# EAGLE design Proiect_TSC_2025 (EAGLE 9.7.0)
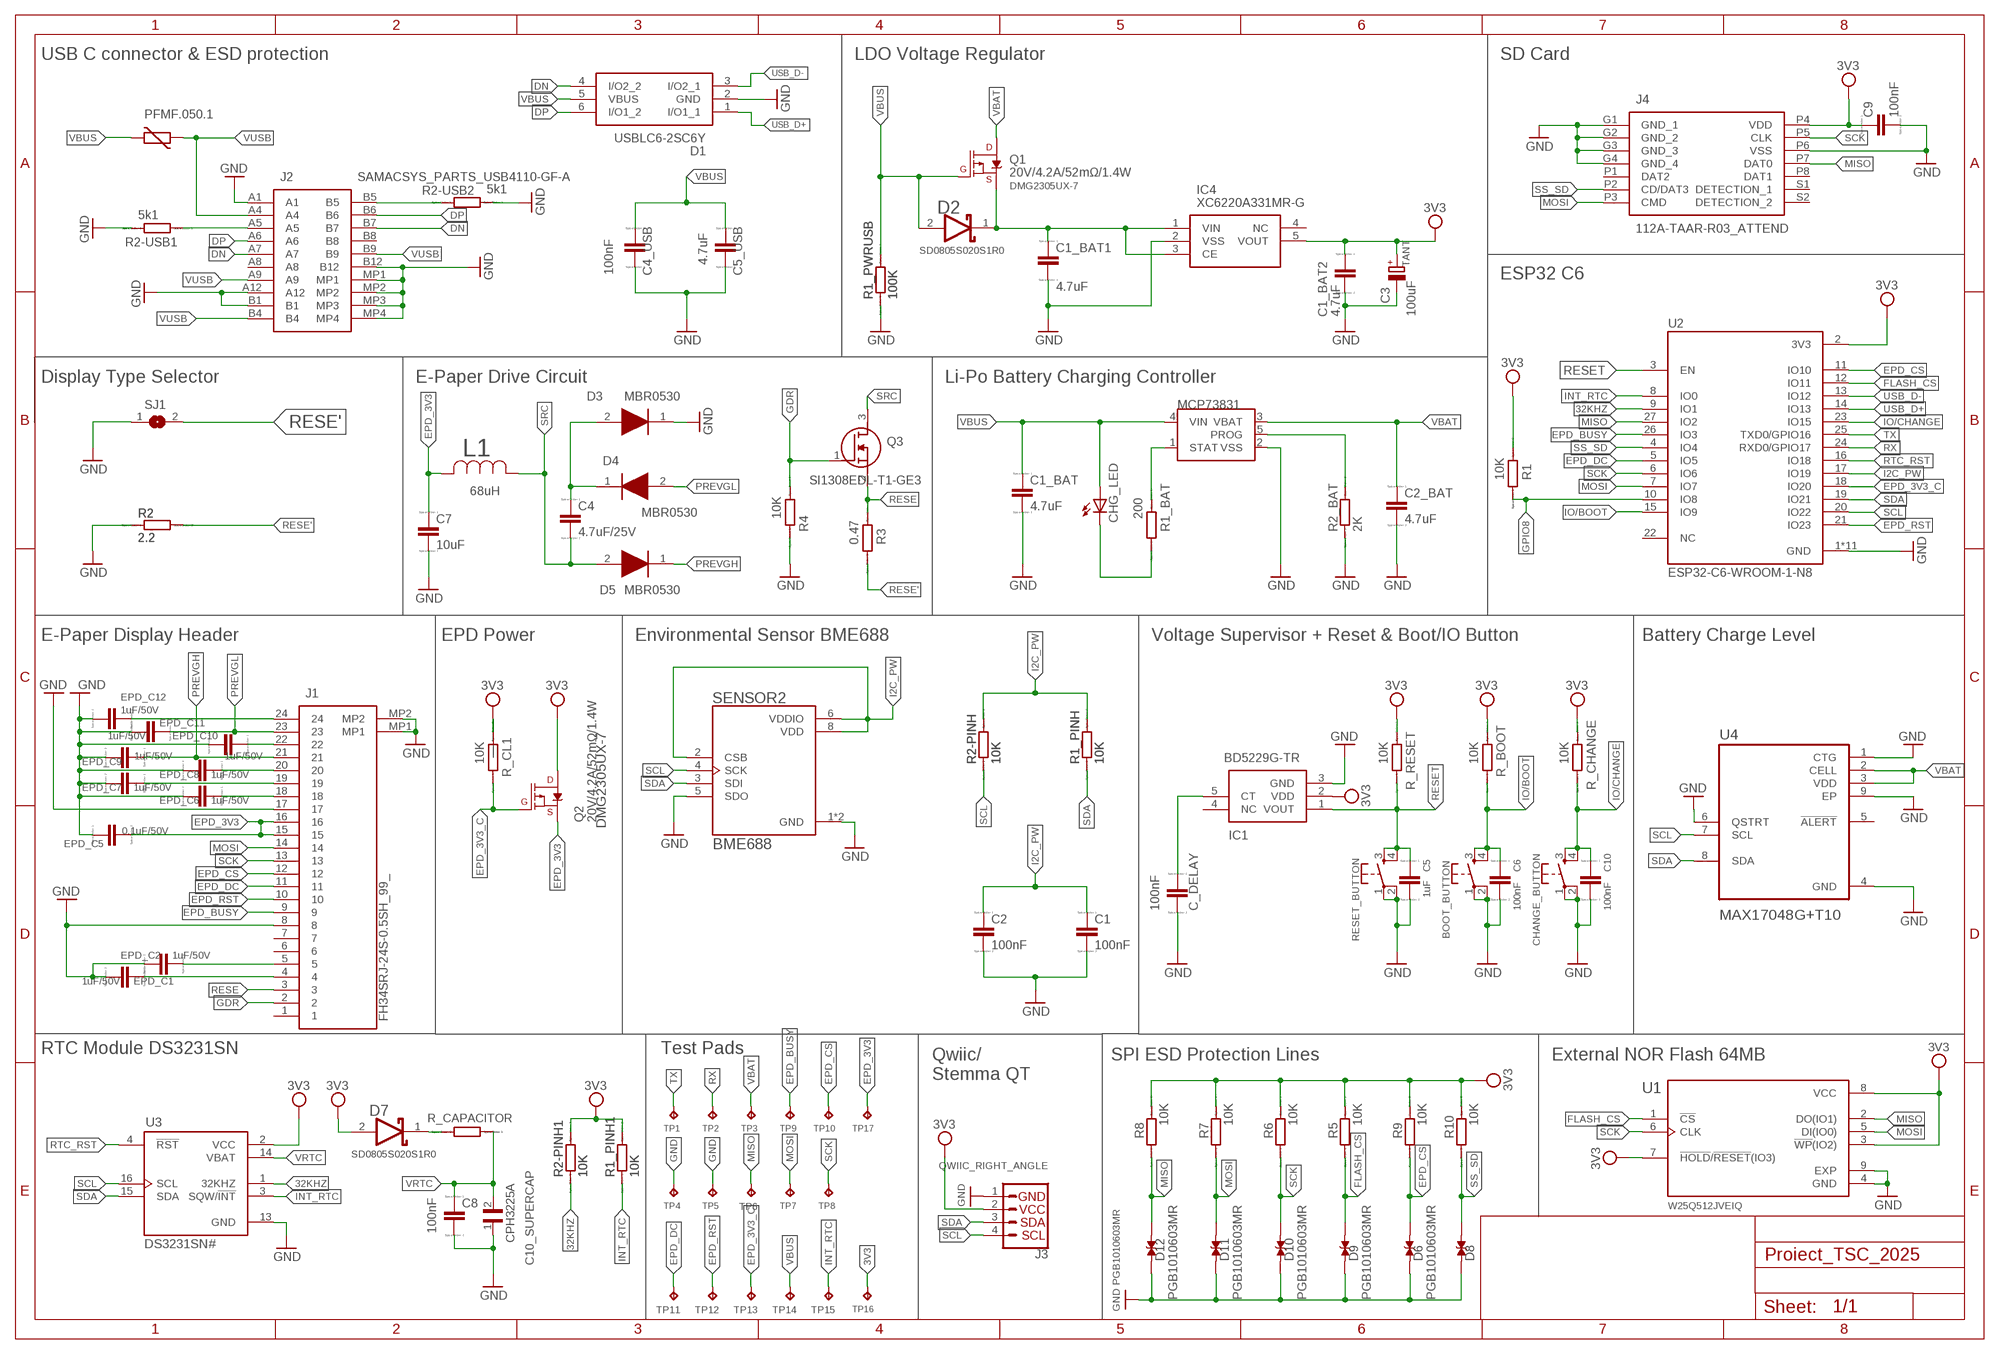
[diagram p0: schematic, sheet 1]

## Parts
BOOT_BUTTON  BUTTON_CUSYOMV1  [MYBUTTON]
C1  100nF  ESP32_WROVER_EAGLE-LTSPICE_CC0402  [ESP32_WROVER_EAGLE-LTSPICE_C0402]
C1_BAT  4.7uF  ESP32_WROVER_EAGLE-LTSPICE_CC0402  [ESP32_WROVER_EAGLE-LTSPICE_C0402]
C1_BAT1  4.7uF  ESP32_WROVER_EAGLE-LTSPICE_CC0402  [ESP32_WROVER_EAGLE-LTSPICE_C0402]
C1_BAT2  4.7uF  ESP32_WROVER_EAGLE-LTSPICE_CC0402  [ESP32_WROVER_EAGLE-LTSPICE_C0402]
C2  100nF  ESP32_WROVER_EAGLE-LTSPICE_CC0402  [ESP32_WROVER_EAGLE-LTSPICE_C0402]
C2_BAT  4.7uF  ESP32_WROVER_EAGLE-LTSPICE_CC0402  [ESP32_WROVER_EAGLE-LTSPICE_C0402]
C3  100uF  RCL_CPOL-EUCT3528  [RCL_CT3528]
C4  4.7uF/25V  ESP32_WROVER_EAGLE-LTSPICE_CC0402  [ESP32_WROVER_EAGLE-LTSPICE_C0402]
C4_USB  100nF  EAGLE-LTSPICE_CC0402  [EAGLE-LTSPICE_C0402]
C5  1uF  ESP32_WROVER_EAGLE-LTSPICE_CC0402  [ESP32_WROVER_EAGLE-LTSPICE_C0402]
C5_USB  4.7uF  EAGLE-LTSPICE_CC0402  [EAGLE-LTSPICE_C0402]
C6  100nF  ESP32_WROVER_EAGLE-LTSPICE_CC0402  [ESP32_WROVER_EAGLE-LTSPICE_C0402]
C7  10uF  ESP32_WROVER_EAGLE-LTSPICE_CC0402  [ESP32_WROVER_EAGLE-LTSPICE_C0402]
C8  100nF  ESP32_WROVER_EAGLE-LTSPICE_CC0402  [ESP32_WROVER_EAGLE-LTSPICE_C0402]
C9  100nF  ESP32_WROVER_EAGLE-LTSPICE_CC0402  [ESP32_WROVER_EAGLE-LTSPICE_C0402]
C10  100nF  ESP32_WROVER_EAGLE-LTSPICE_CC0402  [ESP32_WROVER_EAGLE-LTSPICE_C0402]
C10_SUPERCAP  CPH3225A  [CAPCP3225X100N]
C_DELAY  100nF  ESP32_WROVER_EAGLE-LTSPICE_CC0402  [ESP32_WROVER_EAGLE-LTSPICE_C0402]
CHANGE_BUTTON  CHANGE_BUTTON  BUTTON_CUSYOMV1  [MYBUTTON]
CHG_LED  ADAFRUIT_LEDCHIP-LED0603  [ADAFRUIT_CHIP-LED0603]
D1  USBLC6-2SC6Y  [SOT95P280X145-6N]
D2  ESP32_WROVER_AVX---SD0805S020S1R0_AVX_SD0805S020S1R0_0_0AVX_SD0805S020S1R0_0_0  [ESP32_WROVER_AVX---SD0805S020S1R0_AVX_SD0805S020S1R0_0]
D3  MBR0530  [SOD3716X135N]
D4  MBR0530  [SOD3716X135N]
D5  MBR0530  [SOD3716X135N]
D6  PGB1010603MR  [DIOC1608X36N]
D7  SD0805S020S1R0  ESP32_WROVER_AVX---SD0805S020S1R0_AVX_SD0805S020S1R0_0_0AVX_SD0805S020S1R0_0_0  [ESP32_WROVER_AVX---SD0805S020S1R0_AVX_SD0805S020S1R0_0]
D8  PGB1010603MR  [DIOC1608X36N]
D9  PGB1010603MR  [DIOC1608X36N]
D10  PGB1010603MR  [DIOC1608X36N]
D11  PGB1010603MR  [DIOC1608X36N]
D12  PGB1010603MR  [DIOC1608X36N]
EPD_C1  1uF/50V  ESP32_WROVER_EAGLE-LTSPICE_CC0402  [ESP32_WROVER_EAGLE-LTSPICE_C0402]
EPD_C2  1uF/50V  ESP32_WROVER_EAGLE-LTSPICE_CC0402  [ESP32_WROVER_EAGLE-LTSPICE_C0402]
EPD_C5  0.1uF/50V  ESP32_WROVER_EAGLE-LTSPICE_CC0402  [ESP32_WROVER_EAGLE-LTSPICE_C0402]
EPD_C6  1uF/50V  ESP32_WROVER_EAGLE-LTSPICE_CC0402  [ESP32_WROVER_EAGLE-LTSPICE_C0402]
EPD_C7  1uF/50V  ESP32_WROVER_EAGLE-LTSPICE_CC0402  [ESP32_WROVER_EAGLE-LTSPICE_C0402]
EPD_C8  1uF/50V  ESP32_WROVER_EAGLE-LTSPICE_CC0402  [ESP32_WROVER_EAGLE-LTSPICE_C0402]
EPD_C9  1uF/50V  ESP32_WROVER_EAGLE-LTSPICE_CC0402  [ESP32_WROVER_EAGLE-LTSPICE_C0402]
EPD_C10  1uF/50V  ESP32_WROVER_EAGLE-LTSPICE_CC0402  [ESP32_WROVER_EAGLE-LTSPICE_C0402]
EPD_C11  1uF/50V  ESP32_WROVER_EAGLE-LTSPICE_CC0402  [ESP32_WROVER_EAGLE-LTSPICE_C0402]
EPD_C12  1uF/50V  ESP32_WROVER_EAGLE-LTSPICE_CC0402  [ESP32_WROVER_EAGLE-LTSPICE_C0402]
IC1  BD5229G-TR  [SOT95P280X125-5N]
IC4  XC6220A331MR-G  [SOT95P280X120-5N]
J1  FH34SRJ-24S-0.5SH_99_  [FH34SRJ24S05SH99]
J2  SAMACSYS_PARTS_USB4110-GF-A  [SAMACSYS_PARTS_USB4110GFA]
J3  QWIIC_RIGHT_ANGLE  QWIIC_CONNECTORJS-1MM  [JST04_1MM_RA]
J4  112A-TAAR-R03_ATTEND  [112ATAARR03ATTEND]
L1  68uH  744043680IND_4828-WE-TPC_WRE  [IND_4828-WE-TPC_WRE]
MCP73831  MCP73831  ESP32_WROVER_SPARKFUN-IC-POWER_MCP73831  [ESP32_WROVER_SPARKFUN-IC-POWER_SOT23-5]
PFMF.050.1  ESP32C6_VARISTORCN1812  [ESP32C6_VARISTOR_CT/CN1812]
Q1  20V/4.2A/52mΩ/1.4W  ESP32_WROVER_SPARKFUN-DISCRETESEMI_MOSFET_PCH-DMG2305UX-7  [ESP32_WROVER_SPARKFUN-DISCRETESEMI_SOT23-3]
Q2  20V/4.2A/52mΩ/1.4W  ESP32_WROVER_SPARKFUN-DISCRETESEMI_MOSFET_PCH-DMG2305UX-7  [ESP32_WROVER_SPARKFUN-DISCRETESEMI_SOT23-3]
Q3  SI1308EDL-T1-GE3  [SOT65P210X110-3N]
R1  10K  ESP32_WROVER_EAGLE-LTSPICE_RR0402  [ESP32_WROVER_EAGLE-LTSPICE_R0402]
R1_BAT  200  ESP32_WROVER_EAGLE-LTSPICE_RR0402  [ESP32_WROVER_EAGLE-LTSPICE_R0402]
R1_PINH  10K  ESP32_WROVER_EAGLE-LTSPICE_RR0402  [ESP32_WROVER_EAGLE-LTSPICE_R0402]
R1_PINH1  10K  ESP32_WROVER_EAGLE-LTSPICE_RR0402  [ESP32_WROVER_EAGLE-LTSPICE_R0402]
R1_PWRUSB  100K  ESP32_WROVER_EAGLE-LTSPICE_RR0402  [ESP32_WROVER_EAGLE-LTSPICE_R0402]
R2  2.2  ESP32_WROVER_EAGLE-LTSPICE_RR0402  [ESP32_WROVER_EAGLE-LTSPICE_R0402]
R2-PINH  10K  ESP32_WROVER_EAGLE-LTSPICE_RR0402  [ESP32_WROVER_EAGLE-LTSPICE_R0402]
R2-PINH1  10K  ESP32_WROVER_EAGLE-LTSPICE_RR0402  [ESP32_WROVER_EAGLE-LTSPICE_R0402]
R2-USB1  5k1  ESP32_WROVER_EAGLE-LTSPICE_RR0402  [ESP32_WROVER_EAGLE-LTSPICE_R0402]
R2-USB2  5k1  ESP32_WROVER_EAGLE-LTSPICE_RR0402  [ESP32_WROVER_EAGLE-LTSPICE_R0402]
R2_BAT  2K  ESP32_WROVER_EAGLE-LTSPICE_RR0402  [ESP32_WROVER_EAGLE-LTSPICE_R0402]
R3  0.47  ESP32_WROVER_EAGLE-LTSPICE_RR0402  [ESP32_WROVER_EAGLE-LTSPICE_R0402]
R4  10K  ESP32_WROVER_EAGLE-LTSPICE_RR0402  [ESP32_WROVER_EAGLE-LTSPICE_R0402]
R5  10K  ESP32_WROVER_EAGLE-LTSPICE_RR0402  [ESP32_WROVER_EAGLE-LTSPICE_R0402]
R6  10K  ESP32_WROVER_EAGLE-LTSPICE_RR0402  [ESP32_WROVER_EAGLE-LTSPICE_R0402]
R7  10K  ESP32_WROVER_EAGLE-LTSPICE_RR0402  [ESP32_WROVER_EAGLE-LTSPICE_R0402]
R8  10K  ESP32_WROVER_EAGLE-LTSPICE_RR0402  [ESP32_WROVER_EAGLE-LTSPICE_R0402]
R9  10K  ESP32_WROVER_EAGLE-LTSPICE_RR0402  [ESP32_WROVER_EAGLE-LTSPICE_R0402]
R10  10K  ESP32_WROVER_EAGLE-LTSPICE_RR0402  [ESP32_WROVER_EAGLE-LTSPICE_R0402]
R_BOOT  10K  ESP32_WROVER_EAGLE-LTSPICE_RR0402  [ESP32_WROVER_EAGLE-LTSPICE_R0402]
R_CAPACITOR  ESP32_WROVER_EAGLE-LTSPICE_RR0402  [ESP32_WROVER_EAGLE-LTSPICE_R0402]
R_CHANGE  10K  ESP32_WROVER_EAGLE-LTSPICE_RR0402  [ESP32_WROVER_EAGLE-LTSPICE_R0402]
R_CL1  10K  ESP32_WROVER_EAGLE-LTSPICE_RR0402  [ESP32_WROVER_EAGLE-LTSPICE_R0402]
R_RESET  10K  ESP32_WROVER_EAGLE-LTSPICE_RR0402  [ESP32_WROVER_EAGLE-LTSPICE_R0402]
RESET_BUTTON  BUTTON_CUSYOMV1  [MYBUTTON]
SENSOR2  BME688  ESP32_WROVER_BME680_BME680  [ESP32_WROVER_BME680_PSON80P300X300X100-8N]
SJ1  0  SJ  [SJ]
TP1  TPTP20R  [TP20R]
TP2  TPTP20R  [TP20R]
TP3  TPTP20R  [TP20R]
TP4  TPTP20R  [TP20R]
TP5  TPTP20R  [TP20R]
TP6  TPTP20R  [TP20R]
TP7  TPTP20R  [TP20R]
TP8  TPTP20R  [TP20R]
TP9  TPTP20R  [TP20R]
TP10  TPTP20R  [TP20R]
TP11  TPTP20R  [TP20R]
TP12  TPTP20R  [TP20R]
TP13  TPTP20R  [TP20R]
TP14  TPTP20R  [TP20R]
TP15  TPTP20R  [TP20R]
TP16  TPTP20R  [TP20R]
TP17  TPTP20R  [TP20R]
U1  W25Q512JVEIQ  [SON127P600X800X80-9N]
U2  ESP32-C6-WROOM-1-N8  [XCVR_ESP32-C6-WROOM-1-N8]
U3  DS3231SN#  [SOIC127P1032X265-16N]
U4  MAX17048G+T10  [SON50P200X200X80-9N]

## Nets
3V3: C1_BAT2.1 C3.+ C9.1 D7.2(ANODE) IC1.2(VDD) IC4.5(VOUT) J3.2 J4.P4(VDD) Q2.3(D) R1.2 R1_PINH1.2 R2-PINH1.2 R5.2 R6.2 R7.2 R8.2 R9.2 R10.2 R_BOOT.2 R_CHANGE.2 R_CL1.2 R_RESET.2 TP16.TP U1.3(!WP!(IO2)) U1.7(!HOLD!/!RESET!(IO3)) U1.8(VCC) U2.2(3V3) U3.2(VCC)
32KHZ: R2-PINH1.1 U2.9(IO1) U3.1(32KHZ)
DN: D1.4(I/O2_2) J2.A7 J2.B7
DP: D1.6(I/O1_2) J2.A6 J2.B6
EPD_3V3: C7.1 EPD_C5.2 J1.15 J1.16 L1.2 Q2.2(S) TP17.TP
EPD_3V3_C: Q2.1(G) R_CL1.1 TP13.TP U2.18(IO20)
EPD_BUSY: J1.9 TP9.TP U2.26(IO3)
EPD_CS: D6.2 J1.12 R9.1 TP10.TP U2.11(IO10)
EPD_DC: J1.11 TP11.TP U2.5(IO5)
EPD_RST: J1.10 TP12.TP U2.21(IO23)
FLASH_CS: D9.2 R5.1 U1.1(!CS) U2.12(IO11)
GDR: J1.2 Q3.1(G) R4.2
GND: BOOT_BUTTON.1 BOOT_BUTTON.2 C1.2 C1_BAT1.2 C1_BAT2.2 C1_BAT.2 C2.2 C2_BAT.2 C3.- C4_USB.2 C5.2 C5_USB.2 C6.2 C7.2 C8.2 C9.2 C10.2 C10_SUPERCAP.1 C_DELAY.2 CHANGE_BUTTON.1 CHANGE_BUTTON.2 D1.2(GND) D3.1(K) D6.1 D8.1 D9.1 D10.1 D11.1 D12.1 EPD_C1.2 EPD_C2.2 EPD_C5.1 EPD_C6.2 EPD_C7.2 EPD_C8.2 EPD_C9.2 EPD_C10.2 EPD_C11.2 EPD_C12.2 IC1.3(GND) IC4.2(VSS) J1.8 J1.17 J1.MP1 J1.MP2 J2.A1 J2.A12 J2.B1 J2.B12 J2.MP1 J2.MP2 J2.MP3 J2.MP4 J3.1 J4.G1(GND_1) J4.G2(GND_2) J4.G3(GND_3) J4.G4(GND_4) J4.P6(VSS) MCP73831.2(VSS) R1_PWRUSB.1 R2-USB1.1 R2-USB2.2 R2.1 R2_BAT.1 R4.1 RESET_BUTTON.1 RESET_BUTTON.2 SENSOR2.1(GND) SENSOR2.5(SDO) SENSOR2.7(GND) SJ1.1 TP4.TP TP5.TP U1.4(GND) U1.9(EXP) U2.1(GND) U2.28(GND) U2.29_1(GND) U2.29_2(GND) U2.29_3(GND) U2.29_4(GND) U2.29_5(GND) U2.29_6(GND) U2.29_7(GND) U2.29_8(GND) U2.29_9(GND) U3.13(GND) U4.1(CTG) U4.4(GND) U4.6(QSTRT) U4.9(EP) ; supply symbol labelled GND PGB1010603MR
GPIO8: R1.1 U2.10(IO8)
I2C_PW: C1.1 C2.1 R1_PINH.2 R2-PINH.2 SENSOR2.2(CSB) SENSOR2.6(VDDIO) SENSOR2.8(VDD) U2.17(IO19)
INT_RTC: R1_PINH1.1 TP15.TP U2.8(IO0) U3.3(SQW/!INT)
IO/BOOT: BOOT_BUTTON.3 BOOT_BUTTON.4 C6.1 R_BOOT.1 U2.15(IO9)
IO/CHANGE: C10.1 CHANGE_BUTTON.3 CHANGE_BUTTON.4 R_CHANGE.1 U2.23(IO15)
MISO: D12.2 J4.P7(DAT0) R8.1 TP6.TP U1.2(DO(IO1)) U2.27(IO2)
MOSI: D11.2 J1.14 J4.P3(CMD) R7.1 TP7.TP U1.5(DI(IO0)) U2.7(IO7)
N$1: J2.A5 R2-USB1.2
N$3: J2.B5 R2-USB2.1
N$12: C1_BAT1.1 D2.1(CATHODE) IC4.1(VIN) IC4.3(CE) Q1.2(S)
N$17: C4.1 D3.2(A) D4.1(K)
N$22: CHG_LED.C R1_BAT.1
N$23: MCP73831.1(STAT) R1_BAT.2
N$25: MCP73831.5(PROG) R2_BAT.2
N$28: EPD_C1.1 J1.4
N$29: EPD_C2.1 J1.5
N$37: EPD_C6.1 J1.18
N$38: EPD_C7.1 J1.19
N$39: EPD_C8.1 J1.20
N$41: EPD_C10.1 J1.22
N$43: EPD_C12.1 J1.24
N$56: C_DELAY.1 IC1.5(CT)
N$68: D7.1(CATHODE) R_CAPACITOR.2
PREVGH: D5.1(K) EPD_C9.1 J1.21
PREVGL: D4.2(A) EPD_C11.1 J1.23
RESE: J1.3 Q3.2(S) R3.2
RESE': R2.2 R3.1 SJ1.2
RESET: C5.1 IC1.1(VOUT) R_RESET.1 RESET_BUTTON.3 RESET_BUTTON.4 U2.3(EN)
RTC_RST: U2.16(IO18) U3.4(!RST)
RX: TP2.TP U2.24(RXD0/GPIO17)
SCK: D10.2 J1.13 J4.P5(CLK) R6.1 TP8.TP U1.6(CLK) U2.6(IO6)
SCL: J3.4 R2-PINH.1 SENSOR2.4(SCK) U2.20(IO22) U3.16(SCL) U4.7(SCL)
SDA: J3.3 R1_PINH.1 SENSOR2.3(SDI) U2.19(IO21) U3.15(SDA) U4.8(SDA)
SRC: C4.2 D5.2(A) L1.1 Q3.3(D)
SS_SD: D8.2 J4.P2(CD/DAT3) R10.1 U2.4(IO4)
TX: TP1.TP U2.25(TXD0/GPIO16)
USB_D+: D1.1(I/O1_1) U2.14(IO13)
USB_D-: D1.3(I/O2_1) U2.13(IO12)
VBAT: C2_BAT.1 MCP73831.3(VBAT) Q1.3(D) TP3.TP U4.2(CELL) U4.3(VDD)
VBUS: C1_BAT.1 C4_USB.1 C5_USB.1 CHG_LED.A D1.5(VBUS) D2.2(ANODE) MCP73831.4(VIN) PFMF.050.1.2 Q1.1(G) R1_PWRUSB.2 TP14.TP
VRTC: C8.1 C10_SUPERCAP.2 R_CAPACITOR.1 U3.14(VBAT)
VUSB: J2.A4 J2.A9 J2.B4 J2.B9 PFMF.050.1.1
Unconnected: IC1.4(NC) IC4.4(NC) J1.1 J1.6 J1.7 J2.A8 J2.B8 J4.P1(DAT2) J4.P8(DAT1) J4.S1(DETECTION_1) J4.S2(DETECTION_2) U2.22(NC) U4.5(!ALERT)

## Notes on the sheet
- USB C connector & ESD protection | LDO Voltage Regulator | SD Card
- DMG2305UX-7
- SD0805S020S1R0
- TANT
- ESP32 C6
- Display Type Selector | E-Paper Drive Circuit | Li-Po Battery Charging Controller
- E-Paper Display Header | EPD Power | Environmental Sensor BME688 | Voltage Supervisor + Reset & Boot/IO Button | Battery Charge Level
- DMG2305UX-7
- RTC Module DS3231SN | Test Pads
- Qwiic/
  Stemma QT
- SPI ESD Protection Lines | External NOR Flash 64MB
- SD0805S020S1R0

## Library data of the parts
BOOT_BUTTON CHANGE_BUTTON RESET_BUTTON = DeskAssistant_v19_v1_up:BUTTON_CUSYOMV1
C1 C1_BAT C1_BAT1 C1_BAT2 C2 C2_BAT C4-C10 C_DELAY EPD_C1 EPD_C2 EPD_C5-EPD_C12 = DeskAssistant_v19_v1_up:ESP32_WROVER_EAGLE-LTSPICE_C: CAPACITOR, European symbol; SPICEMODEL: NONE; SPICEPREFIX: C
C3 = DeskAssistant_v19_v1_up:RCL_CPOL-EU: POLARIZED CAPACITOR, European symbol; SPICEPREFIX: C
C4_USB C5_USB = DeskAssistant_v19_v1_up:EAGLE-LTSPICE_C: CAPACITOR, European symbol; SPICEMODEL: NONE; SPICEPREFIX: C
C10_SUPERCAP = DeskAssistant_v19_v1_up:CPH3225A: Cap 0.011F 3.3V 1210 Flat Check availability <https://pricing.snapeda.com/parts/CPH3225A/Seiko%20Instruments/view-part?ref=eda>; AVAILABILITY: Not in stock; CHECK_PRICES: https://www.snapeda.com/parts/CPH3225A/Seiko+Instruments/view-part/?ref=eda; DESCRIPTION: 11 mF (EDLC) Supercapacitor 3.3 V 1210 (3225 Metric) - -; MF: Seiko Instruments; MP: CPH3225A; PACKAGE: 1210 Seiko; PRICE: None; PURCHASE-URL: https://www.snapeda.com/api/url_track_click_mouser/?unipart_id=562593&manufacturer=Seiko Instruments&part_name=CPH3225A&search_term=None; SNAPEDA_LINK: https://www.snapeda.com/parts/CPH3225A/Seiko+Instruments/view-part/?ref=snap
CHG_LED = DeskAssistant_v19_v1_up:ADAFRUIT_LED: LED OSRAM: - CHIPLED LG R971, LG N971, LY N971, LG Q971, LY Q971, LO R971, LY R971 LH N974, LH R974 LS Q976, LO Q976, LY Q976 LO Q996 - Hyper CHIPLED LW Q18S LB Q993, LB Q99A, LB R99A - SideLED LS A670, LO A670, LY A670, LG A670, LP A670 LB A673, LV A673, LT A673, LW A673 LH A674 LY A675 LS A676, LA A676, LO A676, LY A676, LW A676 LS A679, LY A679, LG A679 - Hyper Micro SIDELED® LS Y876, LA Y876, LO Y876, LY Y876 LT Y87S - SmartLED LW L88C, LW L88S LB L89C, LB L89S, LG L890 LS L89K, LO L89K, LY L89K LS L896, LA L896, LO L896, LY L896 - TOPLED LS T670, LO T670, LY T670, LG T670, LP T670 LSG T670, LSP T670, LSY T670, LOP T670, LYG T670 LG T671, LOG T671, LSG T671 LB T673, LV T673, LT T673, LW T673 LH T674 LS T676, LA T676, LO T676, LY T676, LB T676, LH T676, LSB T676, LW T676 LB T67C, LV T67C, LT T67C, LS T67K, LO T67K, LY T67K, LW E67C LS E67B, LA E67B, LO E67B, LY E67B, LB E67C, LV E67C, LT E67C LW T67C LS T679, LY T679, LG T679 LS T770, LO T770, LY T770, LG T770, LP T770 LB T773, LV T773, LT T773, LW T773 LH T774 LS E675, LA E675, LY E675, LS T675 LS T776, LA T776, LO T776, LY T776, LB T776 LHGB T686 LT T68C, LB T68C - Hyper Mini TOPLED® LB M676 - Mini TOPLED Santana® LG M470 LS M47K, LO M47K, LY M47K Source: http://www.osram.convergy.de/
D1 = DeskAssistant_v19_v1_up:USBLC6-2SC6Y: Low Cap. ESD Protection Auto SOT-23-6 STMicroelectronics USBLC6-2SC6Y, Dual Uni-Directional TVS Diode Array, 6-Pin SOT-23 Source: Datasheet <https://componentsearchengine.com/Datasheets/1/USBLC6-2SC6Y.pdf> Check availability <https://pricing.snapeda.com/parts/USBLC6-2SC6Y/STMicroelectronics/view-part?ref=eda>; AVAILABILITY: In Stock; CHECK_PRICES: https://www.snapeda.com/parts/USBLC6-2SC6Y/STMicroelectronics/view-part/?ref=eda; DESCRIPTION: 17V Clamp 5A (8/20µs) Ipp Tvs Diode Surface Mount SOT-23-6; MF: STMicroelectronics; MP: USBLC6-2SC6Y; PACKAGE: SOT-23-6 STMicroelectronics; PRICE: None; SNAPEDA_LINK: https://www.snapeda.com/parts/USBLC6-2SC6Y/STMicroelectronics/view-part/?ref=snap
D2 D7 = DeskAssistant_v19_v1_up:ESP32_WROVER_AVX---SD0805S020S1R0_AVX_SD0805S020S1R0_0_0: Schottky Barrier Rectifier Diode; CENTROID_NOT_SPECIFIED: No; DATASHEET: http://datasheets.avx.com/schottky.pdf; DIGIKEY_DESCRIPTION: DIODE SCHOTTKY 20V 1A 0805; DIGIKEY_PART_NUMBER: 478-7800-1-ND; LEAD_FREE: yes; MF: AVX; MOUSER_PART_NUMBER: 581-SD0805S020S1R0; PACKAGE: 0805 (2012 metric); PREFIX: D; ROHS: yes; TEMPERATURE_RANGE_HIGH: +125°C; TEMPERATURE_RANGE_LOW: -55°C
D3-D5 = DeskAssistant_v19_v1_up:MBR0530: ON SEMICONDUCTOR - MBR0530 - DIODE, SCHOTTKY, 0.5A, 30V, SOD-123 Source: Datasheet <http://www.onsemi.com/pub/Collateral/MBR0530T1-D.PDF> Check availability <https://pricing.snapeda.com/parts/MBR0530/ON%20Semiconductor/view-part?ref=eda>; AVAILABILITY: In Stock; CHECK_PRICES: https://www.snapeda.com/parts/MBR0530/Onsemi/view-part/?ref=eda; DESCRIPTION: Diode Schottky 30 V 500mA Surface Mount SOD-123; MF: ON Semiconductor; MP: MBR0530; PACKAGE: SOD-123-2 ON Semiconductor; PRICE: None; PURCHASE-URL: https://www.snapeda.com/api/url_track_click_mouser/?unipart_id=179458&manufacturer=ON Semiconductor&part_name=MBR0530&search_term=None; SNAPEDA_LINK: https://www.snapeda.com/parts/MBR0530/Onsemi/view-part/?ref=snap
D6 D8-D12 = DeskAssistant_v19_v1_up:PGB1010603MR: Check availability <https://pricing.snapeda.com/parts/PGB1010603MR/Littelfuse%20Inc./view-part?ref=eda>; AVAILABILITY: In Stock; CHECK_PRICES: https://www.snapeda.com/parts/PGB1010603MR/Littelfuse/view-part/?ref=eda; DESCRIPTION: 150V (Typ) Clamp - Ipp Tvs Diode Surface Mount 0603 (1608 Metric); MF: Littelfuse Inc.; MP: PGB1010603MR; PACKAGE: 0603 Littelfuse Inc.; PRICE: None; PURCHASE-URL: https://www.snapeda.com/api/url_track_click_mouser/?unipart_id=5659453&manufacturer=Littelfuse Inc.&part_name=PGB1010603MR&search_term=None; SNAPEDA_LINK: https://www.snapeda.com/parts/PGB1010603MR/Littelfuse/view-part/?ref=snap
IC1 = DeskAssistant_v19_v1_up:BD5229G-TR: Voltage Detector with Adjustable Delay Time: CMOS processes are utilized to develop high precision, low current consumption CMOS reset ICs that allow arbitrary setting of the delay time. The extensive lineup includes both Nch Open Drain and CMOS output types in a wide range of detection voltages (from 2.3V to 6.0V, in 0.1V steps), enabling selection of the ideal solution based on customer requirements. In addition, the entire series is of course both lead-free and RoHS-compliant. Source: Datasheet <https://datasheet.datasheetarchive.com/originals/distributors/Datasheets_SAMA/f2b9741ef86007909f138d561a359946.pdf>; DESCRIPTION: Voltage Detector with Adjustable Delay Time: CMOS processes are utilized to develop high precision, low current consumption CMOS reset ICs that allow arbitrary setting of the delay time. The extensive lineup includes both Nch Open Drain and CMOS output types in a wide range of detection voltages (from 2.3V to 6.0V, in 0.1V steps), enabling selection of the ideal solution based on customer requirements. In addition, the entire series is of course both lead-free and RoHS-compliant.; HEIGHT: 1.25mm; MANUFACTURER_NAME: ROHM Semiconductor; MANUFACTURER_PART_NUMBER: BD5229G-TR; MOUSER_PART_NUMBER: 755-BD5229G-TR; MOUSER_PRICE-STOCK: https://www.mouser.co.uk/ProductDetail/ROHM-Semiconductor/BD5229G-TR?qs=4kLU8WoGk0vvnhrrYwdszw%3D%3D
IC4 = DeskAssistant_v19_v1_up:XC6220A331MR-G: LDO Voltage Regulators Source: Datasheet <https://www.torexsemi.com/file/xc6220/XC6220.pdf>; DESCRIPTION: LDO Voltage Regulators; HEIGHT: 1.2mm; MANUFACTURER_NAME: Torex; MANUFACTURER_PART_NUMBER: XC6220A331MR-G; MOUSER_PART_NUMBER: 865-XC6220A331MR-G; MOUSER_PRICE-STOCK: https://www.mouser.co.uk/ProductDetail/Torex-Semiconductor/XC6220A331MR-G?qs=AsjdqWjXhJ8ZSWznL1J0gg%3D%3D
J1 = DeskAssistant_v19_v1_up:FH34SRJ-24S-0.5SH_99_: 24 Position FFC, FPC Connector Contacts, Top and Bottom 0.020" (0.50mm) Surface Mount, Right Angle Source: Datasheet <https://www.hirose.com/en/product/document?clcode=CL0580-1255-6-99&productname=FH34SRJ-24S-0.5SH(99)&series=FH34SRJ&documenttype=2DDrawing&lang=en&documentid=0000990903>; DESCRIPTION: 24 Position FFC, FPC Connector Contacts, Top and Bottom 0.020" (0.50mm) Surface Mount, Right Angle; HEIGHT: 1.1mm; MANUFACTURER_NAME: Hirose; MANUFACTURER_PART_NUMBER: FH34SRJ-24S-0.5SH(99); MOUSER_PART_NUMBER: 798-FH34SRJ24S05SH99; MOUSER_PRICE-STOCK: https://www.mouser.co.uk/ProductDetail/Hirose-Connector/FH34SRJ-24S-0.5SH99?qs=vcbW%252B4%252BSTIpKBl5ap9J8Fw%3D%3D
J2 = DeskAssistant_v19_v1_up:SAMACSYS_PARTS_USB4110-GF-A: CONN USB 2.0 TYPE-C R/A SMT Source: Datasheet <https://gct.co/files/drawings/usb4110.pdf>; DESCRIPTION: CONN USB 2.0 TYPE-C R/A SMT; HEIGHT: 3.26mm; MANUFACTURER_NAME: GCT (GLOBAL CONNECTOR TECHNOLOGY); MANUFACTURER_PART_NUMBER: USB4110-GF-A; MOUSER_PART_NUMBER: 640-USB4110-GF-A; MOUSER_PRICE-STOCK: https://www.mouser.co.uk/ProductDetail/GCT/USB4110-GF-A?qs=KUoIvG%2F9IlYiZvIXQjyJeA%3D%3D
J3 = DeskAssistant_v19_v1_up:QWIIC_CONNECTOR: SparkFun I2C Standard Qwiic Connector An SMD 1mm pitch JST connector makes it easy and quick (get it? Qwiic?) to connect I2C devices to each other. The Qwiic system <http://www.sparkfun.com/qwiic> enables fast and solderless connection between popular platforms and various sensors and actuators. We carry 200mm <https://www.sparkfun.com/products/14204>, 100mm <https://www.sparkfun.com/products/14205>, 50mm <https://www.sparkfun.com/products/14206>, and breadboard friendly <https://www.sparkfun.com/products/14207> Qwiic cables. We also offer 10 pcs strips <https://www.sparkfun.com/products/14323> the SMD connectors.; PROD_ID: CONN-13694
J4 = DeskAssistant_v19_v1_up:112A-TAAR-R03_ATTEND: Micro SD Card Socket, Push-Push Type, Top Mount, SMT, H=1.83mm, 10u Source: Datasheet <https://www.attend.com.tw/data/download/file/112A-TAAR-R03.pdf>; DESCRIPTION: Micro SD Card Socket, Push-Push Type, Top Mount, SMT, H=1.83mm, 10u; HEIGHT: 1.9mm; MANUFACTURER_NAME: ATTEND; MANUFACTURER_PART_NUMBER: 112A-TAAR-R03 ATTEND
L1 = DeskAssistant_v19_v1_up:744043680; COPYRIGHT: Copyright (C) 2024 Ultra Librarian. All rights reserved.; MANUFACTURER_PART_NUMBER: 744043680; MFR_NAME: Wurth Electronics
MCP73831 = DeskAssistant_v19_v1_up:ESP32_WROVER_SPARKFUN-IC-POWER_MCP73831: MCP73831T Li-Ion, Li-Pol Controller Miniature single cell, fully integrated Li-Ion, Li-polymer charge management controller Datasheet <http://ww1.microchip.com/downloads/en/DeviceDoc/20001984g.pdf> SparkFun Products: SparkFun ESP32 Thing <https://www.sparkfun.com/products/13907> SparkFun 9DoF Razor IMU M0 <https://www.sparkfun.com/products/14001>; PROD_ID: IC-09995
PFMF.050.1 = DeskAssistant_v19_v1_up:ESP32C6_VARISTOR: VARISTOR
Q1 Q2 = DeskAssistant_v19_v1_up:ESP32_WROVER_SPARKFUN-DISCRETESEMI_MOSFET_PCH: P-channel MOSFETs Voltage controlled devices that allow control of high current outputs. SparkFun Products: SparkFun ESP32 Thing <https://www.sparkfun.com/products/13907> SparkFun ESP8266 Thing <https://www.sparkfun.com/products/13231> SparkFun Pi Servo HAT V2 <https://www.sparkfun.com/products/15316> DMG2305UX-7 (20V/4.2A/SOT23-3); PROD_ID: TRAN-14388
Q3 = DeskAssistant_v19_v1_up:SI1308EDL-T1-GE3: MOSFET N-Ch 30V 1.5A TrenchFET SC70 Vishay Si1308EDL-T1-GE3 N-channel MOSFET Transistor, 1.5 A, 30 V, 3-Pin SC-70 Source: Datasheet <https://componentsearchengine.com/Datasheets/1/SI1308EDL-T1-GE3.pdf> Check availability <https://pricing.snapeda.com/parts/SI1308EDL-T1-GE3/Vishay%20Siliconix/view-part?ref=eda>; AVAILABILITY: In Stock; CHECK_PRICES: https://www.snapeda.com/parts/SI1308EDL-T1-GE3/Vishay+Siliconix/view-part/?ref=eda; DESCRIPTION: Si1308EDL-T1-GE3 N-channel MOSFET Transistor, 1.5 A, 30 V, 3-Pin SC-70 | Siliconix / Vishay SI1308EDL-T1-GE3; MF: Vishay Siliconix; MP: SI1308EDL-T1-GE3; PACKAGE: SOT-323 Vishay Semiconductor; PRICE: None; PURCHASE-URL: https://www.snapeda.com/api/url_track_click_mouser/?unipart_id=274603&manufacturer=Vishay Siliconix&part_name=SI1308EDL-T1-GE3&search_term=None; SNAPEDA_LINK: https://www.snapeda.com/parts/SI1308EDL-T1-GE3/Vishay+Siliconix/view-part/?ref=snap
R1 R1_BAT R1_PINH R1_PINH1 R1_PWRUSB R2 R2-PINH R2-PINH1 R2-USB1 R2-USB2 R2_BAT R3-R10 R_BOOT R_CAPACITOR R_CHANGE R_CL1 R_RESET = DeskAssistant_v19_v1_up:ESP32_WROVER_EAGLE-LTSPICE_R: RESISTOR, European symbol; SPICEMODEL: NONE; SPICEPREFIX: R
SENSOR2 = DeskAssistant_v19_v1_up:ESP32_WROVER_BME680_BME680: Integrated Environmental Unit; AVAILABILITY: Unavailable; DESCRIPTION: Integrated Environmental Unit; MF: Bosch Sensortec; MP: BME680; PACKAGE: LGA-8 Bosch Tools; PRICE: None
SJ1 = DeskAssistant_v19_v1_up:SJ: SMD solder JUMPER
TP1-TP17 = DeskAssistant_v19_v1_up:TP: Test pad
U1 = DeskAssistant_v19_v1_up:W25Q512JVEIQ: Check availability <https://pricing.snapeda.com/parts/W25Q512JVEIQ/Winbond%20Electronics/view-part?ref=eda>; AVAILABILITY: In Stock; CHECK_PRICES: https://www.snapeda.com/parts/W25Q512JVEIQ/Winbond+Electronics/view-part/?ref=eda; DESCRIPTION: FLASH - NOR Memory IC 512Mb (64M x 8) SPI - Quad I/O 133 MHz 8-WSON (8x6); MF: Winbond Electronics; MP: W25Q512JVEIQ; PACKAGE: Package; PRICE: None; SNAPEDA_LINK: https://www.snapeda.com/parts/W25Q512JVEIQ/Winbond+Electronics/view-part/?ref=snap
U2 = DeskAssistant_v19_v1_up:ESP32-C6-WROOM-1-N8: Check availability <https://pricing.snapeda.com/parts/ESP32-C6-WROOM-1-N8/Espressif%20Systems/view-part?ref=eda>; AVAILABILITY: In Stock; CHECK_PRICES: https://www.snapeda.com/parts/ESP32-C6-WROOM-1-N8/Espressif+Systems/view-part/?ref=eda; DESCRIPTION: Multiprotocol Modules ESP32-C6 module, Wi-Fi 6 in 2.4 GHz band, Bluetooth 5, Zigbee 3.0 and Thread. ESP34-WROOM Compatible - ENGINEERING SAMPLE; MF: Espressif Systems; MP: ESP32-C6-WROOM-1-N8; PACKAGE: None; PRICE: None; SNAPEDA_LINK: https://www.snapeda.com/parts/ESP32-C6-WROOM-1-N8/Espressif+Systems/view-part/?ref=snap
U3 = DeskAssistant_v19_v1_up:DS3231SN#: Real Time Clock Serial 16-Pin SOIC W T/R Check availability <https://pricing.snapeda.com/parts/DS3231SN%23/Analog%20Devices/view-part?ref=eda>; AVAILABILITY: In Stock; CHECK_PRICES: https://www.snapeda.com/parts/DS3231SN%23/Analog+Devices/view-part/?ref=eda; DESCRIPTION: Extremely Accurate I²C-Integrated RTC/TCXO/Crystal; MF: Analog Devices; MP: DS3231SN#; PACKAGE: SOIC-16 Maxim; PRICE: None; PURCHASE-URL: https://www.snapeda.com/api/url_track_click_mouser/?unipart_id=99048&manufacturer=Analog Devices&part_name=DS3231SN#&search_term=None; SNAPEDA_LINK: https://www.snapeda.com/parts/DS3231SN%23/Analog+Devices/view-part/?ref=snap
U4 = DeskAssistant_v19_v1_up:MAX17048G+T10: Check availability <https://pricing.snapeda.com/parts/MAX17048G%2BT10/Analog%20Devices/view-part?ref=eda>; AVAILABILITY: In Stock; CHECK_PRICES: https://www.snapeda.com/parts/MAX17048G+T10/Analog+Devices/view-part/?ref=eda; DESCRIPTION: 3µA 1-Cell/2-Cell Fuel Gauge with ModelGauge; MF: Analog Devices; MP: MAX17048G+T10; PACKAGE: TDFN-8 Maxim; PRICE: None; PURCHASE-URL: https://www.snapeda.com/api/url_track_click_mouser/?unipart_id=329239&manufacturer=Analog Devices&part_name=MAX17048G+T10&search_term=None; SNAPEDA_LINK: https://www.snapeda.com/parts/MAX17048G+T10/Analog+Devices/view-part/?ref=snap

## Board
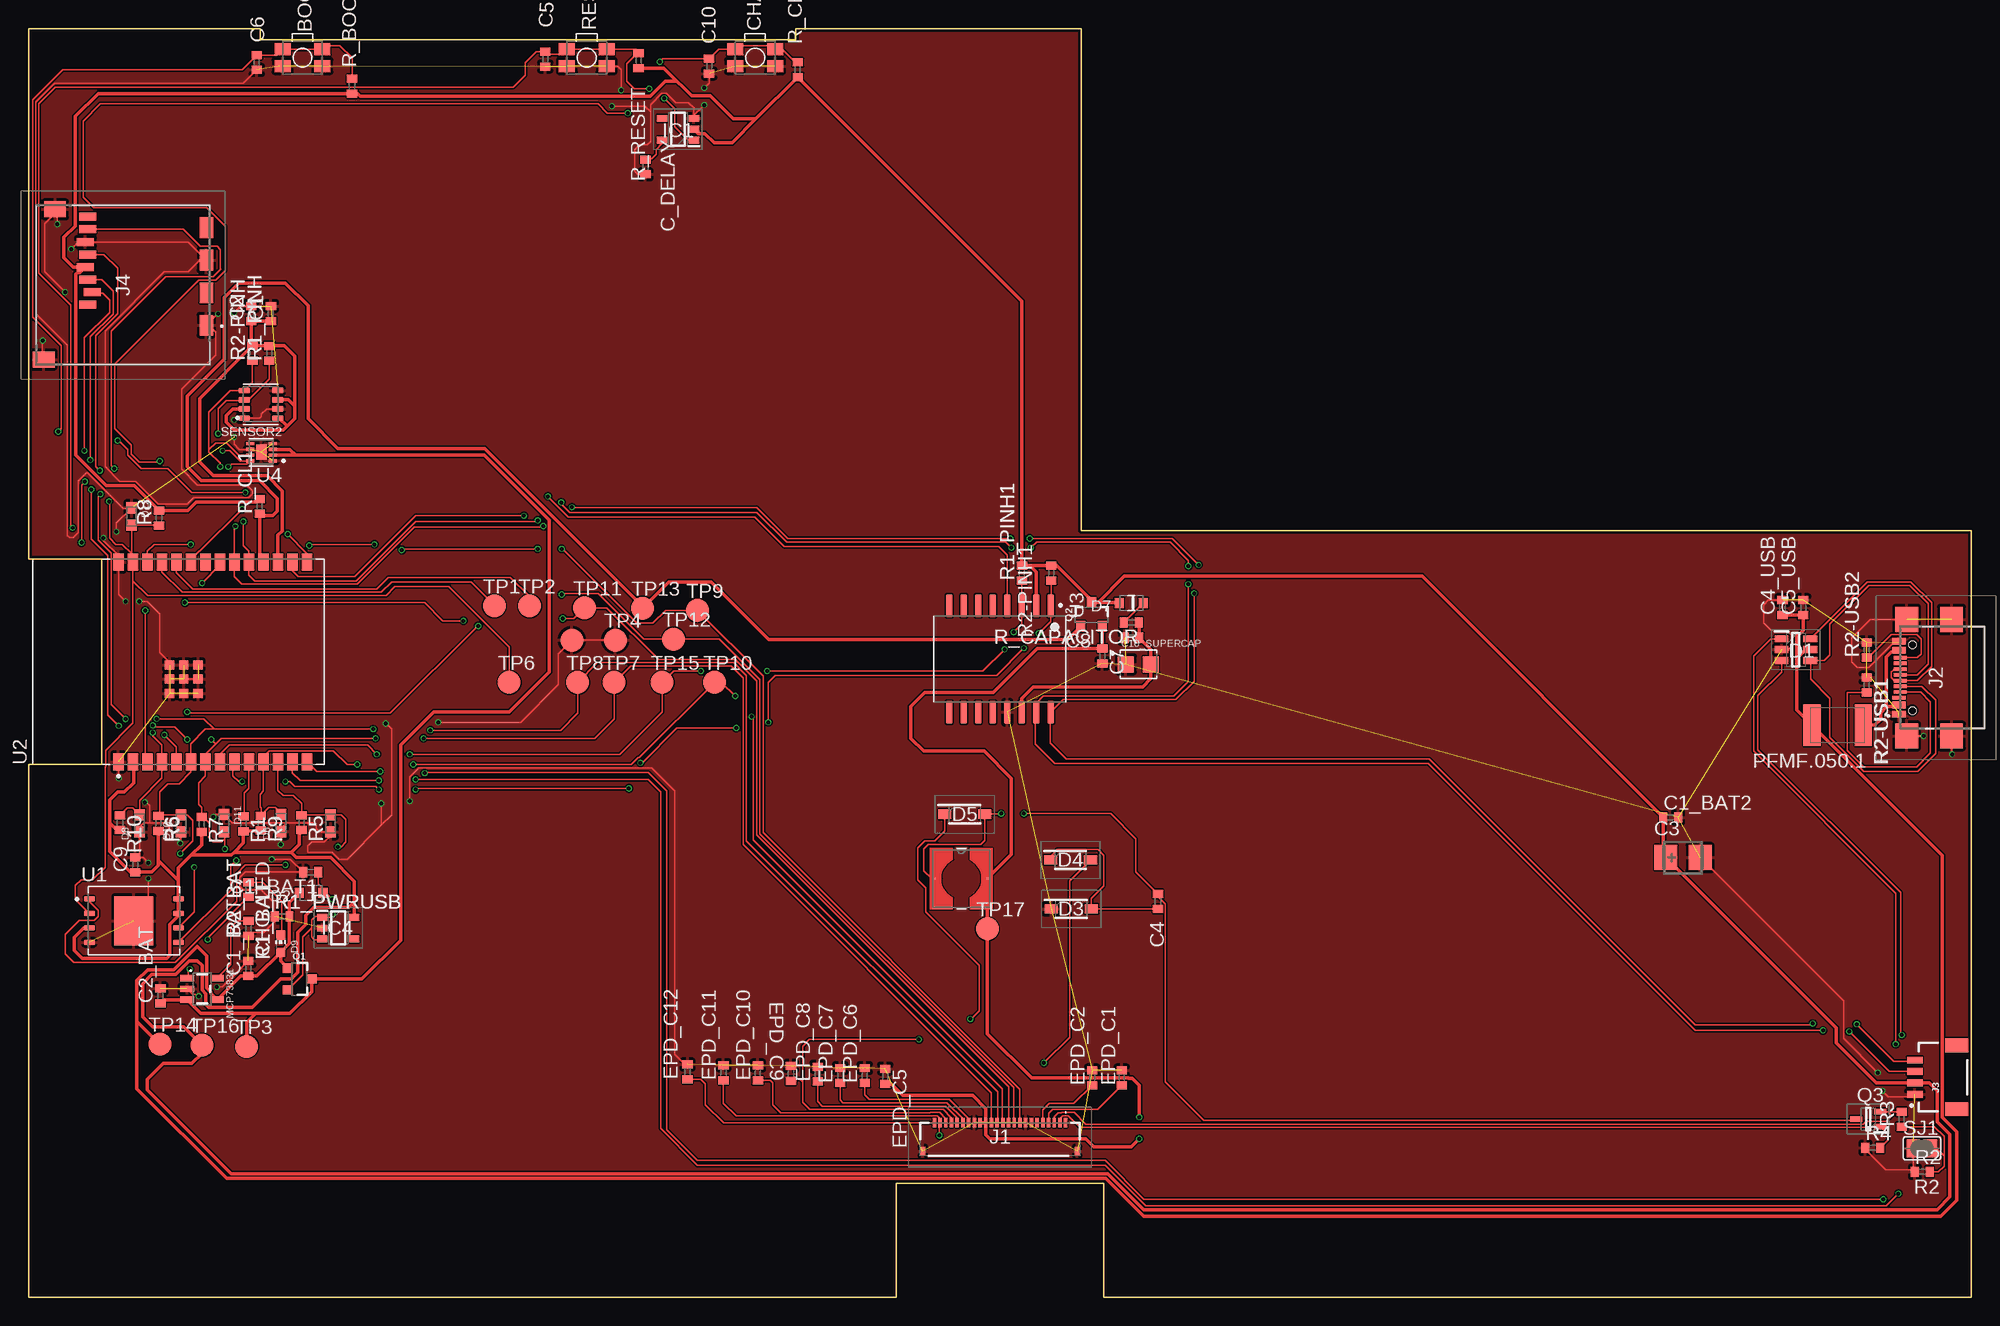
[diagram p1: board, top side]
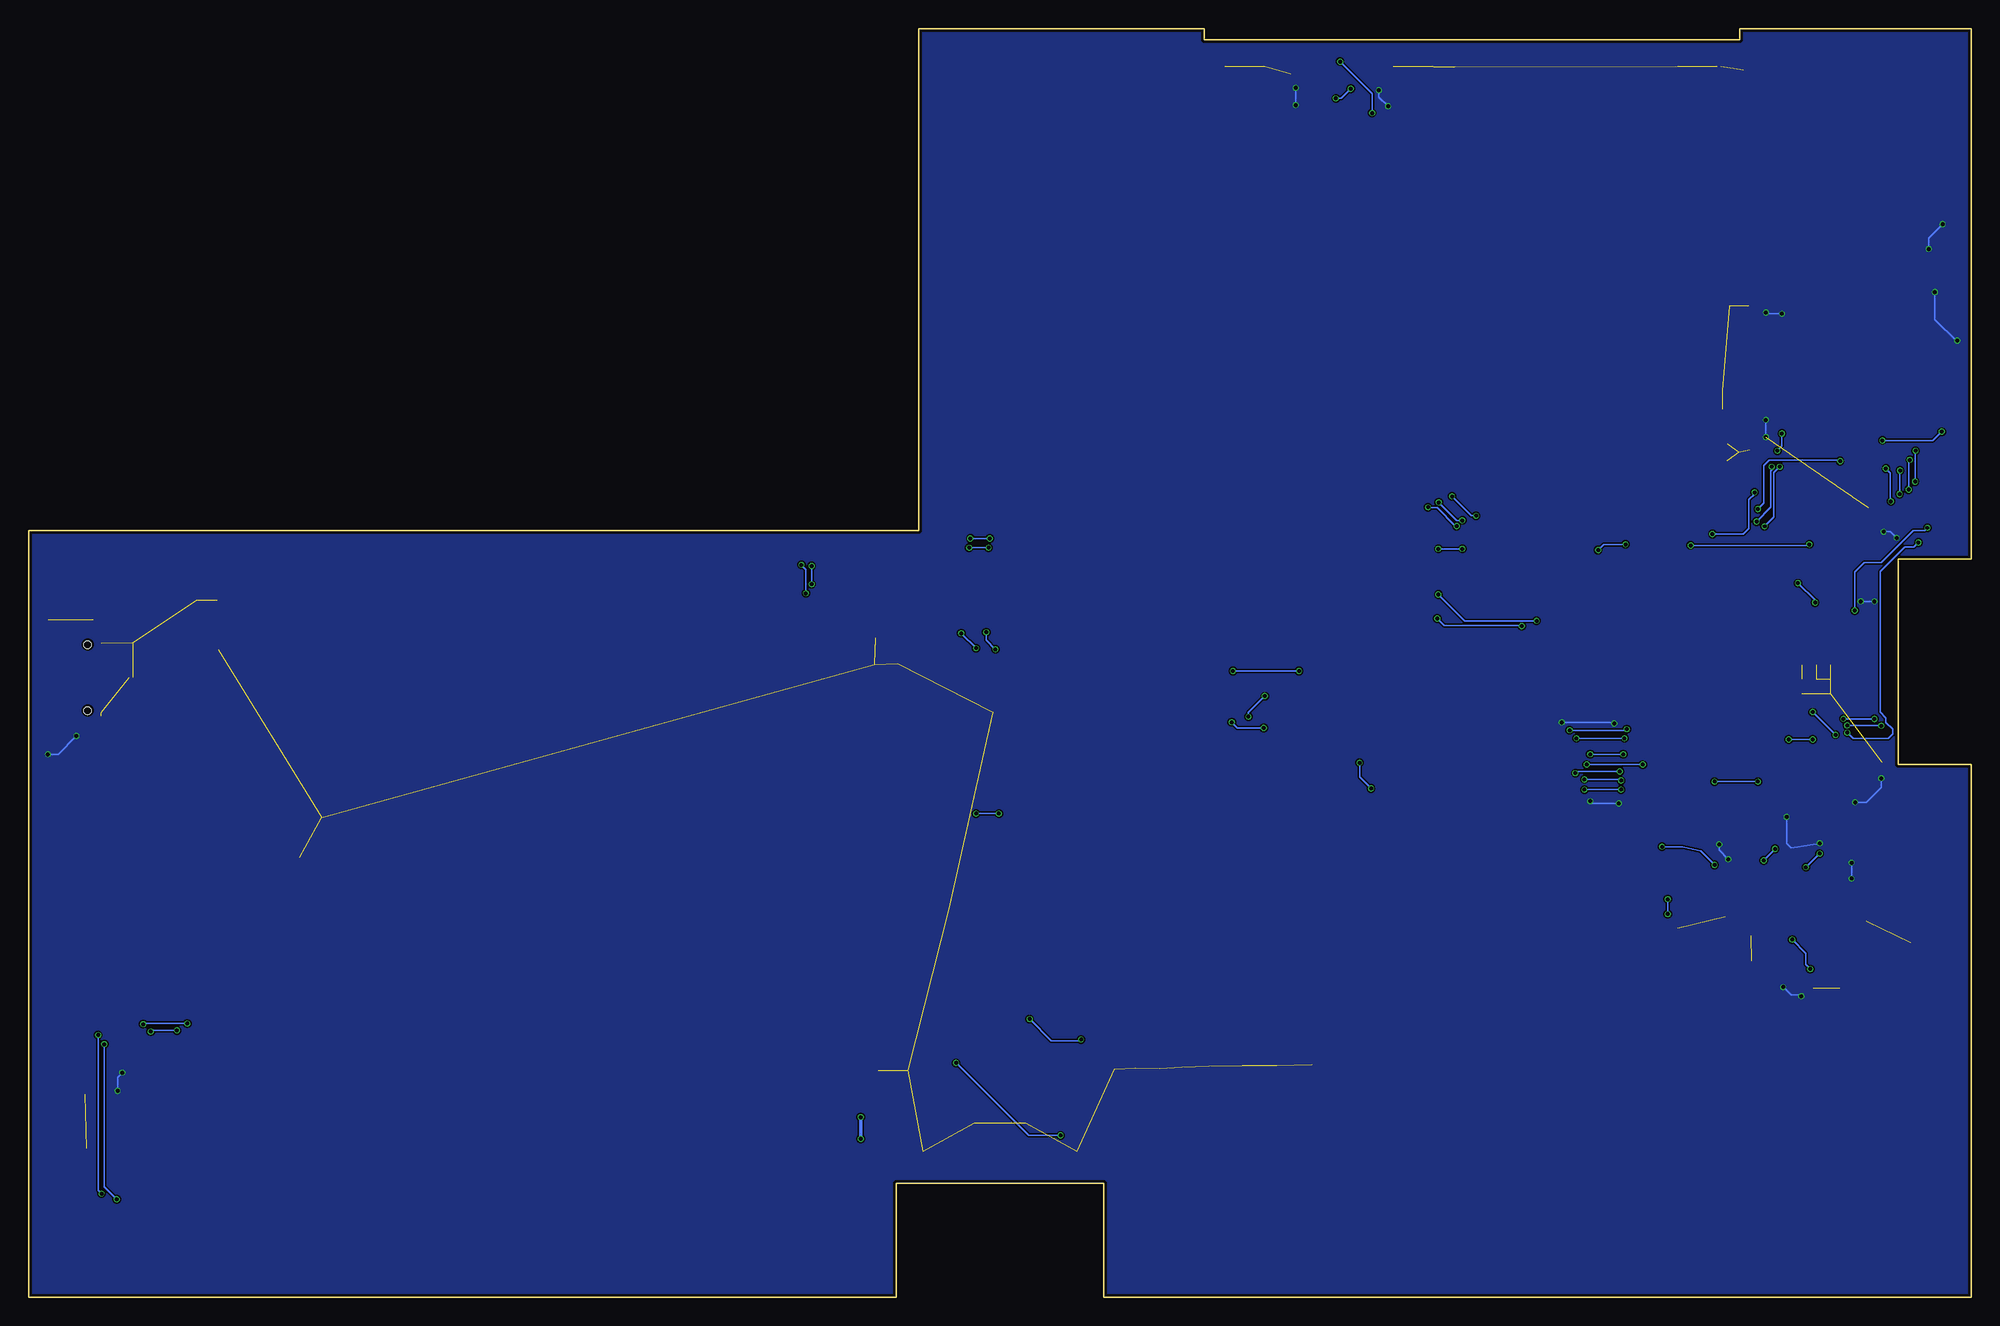
[diagram p2: board, bottom side, seen from below]

Size 170.2 x 111.2 mm. Coordinates in mm from the lower left corner, seen from the top.
Outline: 0,111.2 20.3,111.2 20.3,110.2 67.2,110.2 67.2,111.2 92.2,111.2 92.2,67.2 170.2,67.2 170.2,0 94.2,0 94.2,10 76,10 76,0 0,0 0,46.7 6.4,46.7 6.4,64.7 0,64.7 0,111.2
Copper layers (1*16): Top 0.035mm / dielectric 1.6mm / Bottom 0.035mm
Design rules "jlcpcb-2layers.dru": minimum track width 5mil, minimum drill 0.3mm, track to track 5mil, track to pad 5mil, pad to pad 5mil, via to via 5mil, smd to smd 5mil, copper to edge 0.2mm, drill to drill 6mil, minimum pad ring 10mil, minimum via ring 3mil, stop-mask expansion 4mil, vias tented up to drill 0mil, thermal gap 10mil

### Footprints (pad centres in the part's own frame; a part is rotated, then mirrored left to right if it is on the bottom)
MYBUTTON = smd 1.4 x 1.05: 1 1.75,0.75; 2 -1.75,0.75; 3 -1.75,-0.75; 4 1.75,-0.75
ESP32_WROVER_EAGLE-LTSPICE_C0402 = smd 0.7 x 0.9: 1 -0.65,0; 2 0.65,0
RCL_CT3528 = smd 2 x 2.2: + -1.5,0; - 1.5,0
EAGLE-LTSPICE_C0402 = smd 0.7 x 0.9: 1 -0.65,0; 2 0.65,0
CAPCP3225X100N = smd 1.4 x 1.4: 1 -1.1,0; 2 1.1,0
ADAFRUIT_CHIP-LED0603 = smd 0.8 x 0.8: A 0,-0.75; C 0,0.75
SOT95P280X145-6N = smd 1.2 x 0.6: 1 -1.25,0.95; 2 -1.25,0; 3 -1.25,-0.95; 4 1.25,-0.95; 5 1.25,0; 6 1.25,0.95
ESP32_WROVER_AVX---SD0805S020S1R0_AVX_SD0805S020S1R0_0 = smd 0.8 x 0.9: 1 -1.05,0; 2 1.05,0
SOD3716X135N = smd 1.15 x 0.8: 1 -1.75,0; 2 1.75,0
DIOC1608X36N = smd 0.97 x 0.94: 1 -0.75,0; 2 0.75,0
SOT95P280X125-5N = smd 0.9 x 0.6: 1 -1.4,0.95; 2 -1.4,0; 3 -1.4,-0.95; 4 1.4,-0.95; 5 1.4,0.95
SOT95P280X120-5N = smd 0.9 x 0.6: 1 -1.4,0.95; 2 -1.4,0; 3 -1.4,-0.95; 4 1.4,-0.95; 5 1.4,0.95
FH34SRJ24S05SH99 = smd 0.3 x 0.8: 1 5.75,1.45; 2 5.25,1.45; 3 4.75,1.45; 4 4.25,1.45; 5 3.75,1.45; 6 3.25,1.45; 7 2.75,1.45; 8 2.25,1.45; 9 1.75,1.45; 10 1.25,1.45; 11 0.75,1.45; 12 0.25,1.45; 13 -0.25,1.45; 14 -0.75,1.45; 15 -1.25,1.45; 16 -1.75,1.45; 17 -2.25,1.45; 18 -2.75,1.45; 19 -3.25,1.45; 20 -3.75,1.45; 21 -4.25,1.45; 22 -4.75,1.45; 23 -5.25,1.45; 24 -5.75,1.45 | smd 0.4 x 0.8: MP1 6.75,-1.05; MP2 -6.75,-1.05
SAMACSYS_PARTS_USB4110GFA = smd 0.3 x 1.143: A1 -3.35,3.778; A4 -2.55,3.778; A5 -1.25,3.678; A6 -0.25,3.678; A7 0.25,3.678; A8 1.25,3.678; A9 2.55,3.778; A12 3.35,3.778; B1 3.05,3.778; B4 2.25,3.778; B5 1.75,3.678; B6 0.75,3.678; B7 -0.75,3.678; B8 -1.75,3.778; B9 -2.25,3.778; B12 -3.05,3.778 | smd 2.18 x 2: MP1 -5.11,-0.827; MP2 5.11,-0.827; MP3 -5.11,3.103; MP4 5.11,3.103 | hole 0.65: -2.89,2.603; 2.89,2.603
JST04_1MM_RA = smd 0.6 x 1.35: 1 -1.5,0; 2 -0.5,0; 3 0.5,0; 4 1.5,0 | smd 1.2 x 2: NC1 2.8,-3.675; NC2 -2.8,-3.675
112ATAARR03ATTEND = smd 1.8 x 1.2: G1 10.6,10.4; G2 4.9,10.4; S1 7.75,10.4; S2 2.05,10.4 | smd 1.4 x 1.9: G3 13.6,-3.85; G4 0.45,-2.85 | smd 0.7 x 1.5: P1 8.8,0; P2 7.7,0.4; P3 6.6,0; P4 5.5,-0.2; P5 4.4,0; P6 3.3,-0.2; P7 2.2,0; P8 1.1,0
IND_4828-WE-TPC_WRE = smd 0.127 x 0.127: 1 -2.286,0; 2 2.286,0
ESP32_WROVER_SPARKFUN-IC-POWER_SOT23-5 = smd 0.55 x 1.2: 1 -0.95,-1.3; 2 0,-1.3; 3 0.95,-1.3; 4 0.95,1.3; 5 -0.95,1.3
ESP32C6_VARISTOR_CT/CN1812 = smd 1.5 x 3.6: 1 -2.25,0; 2 2.25,0
ESP32_WROVER_SPARKFUN-DISCRETESEMI_SOT23-3 = smd 0.8 x 0.9: 1 -0.95,-1; 2 0.95,-1; 3 0,1.1
SOT65P210X110-3N = smd 1.05 x 0.5: 1 -1.05,0.65; 2 -1.05,-0.65; 3 1.05,0
ESP32_WROVER_EAGLE-LTSPICE_R0402 = smd 0.7 x 0.9: 1 -0.65,0; 2 0.65,0
ESP32_WROVER_BME680_PSON80P300X300X100-8N = smd 1.016 x 0.5: 1 1.458,1.2; 2 1.458,0.4; 3 1.458,-0.4; 4 1.458,-1.2; 5 -1.458,-1.22; 6 -1.458,-0.4; 7 -1.458,0.4; 8 -1.458,1.2
SJ = smd 1.168 x 1.6: 1 -0.762,0; 2 0.762,0
TP20R = smd 2 x 2: TP 0,0
SON127P600X800X80-9N = smd 0.94 x 0.44: 1 -3.895,1.905; 2 -3.895,0.635; 3 -3.895,-0.635; 4 -3.895,-1.905; 5 3.895,-1.905; 6 3.895,-0.635; 7 3.895,0.635; 8 3.895,1.905 | smd 3.4 x 4.3: 9 0,0
XCVR_ESP32-C6-WROOM-1-N8 = smd 1.5 x 0.9: 1 -8.75,5.26; 2 -8.75,3.99; 3 -8.75,2.72; 4 -8.75,1.45; 5 -8.75,0.18; 6 -8.75,-1.09; 7 -8.75,-2.36; 8 -8.75,-3.63; 9 -8.75,-4.9; 10 -8.75,-6.17; 11 -8.75,-7.44; 12 -8.75,-8.71; 13 -8.75,-9.98; 14 -8.75,-11.25; 15 8.75,-11.25; 16 8.75,-9.98; 17 8.75,-8.71; 18 8.75,-7.44; 19 8.75,-6.17; 20 8.75,-4.9; 21 8.75,-3.63; 22 8.75,-2.36; 23 8.75,-1.09; 24 8.75,0.18; 25 8.75,1.45; 26 8.75,2.72; 27 8.75,3.99; 28 8.75,5.26 | smd 0.8 x 0.8: 29_1 -2.755,0.79; 29_2 -1.505,0.79; 29_3 -0.255,0.79; 29_4 -2.755,-0.46; 29_5 -1.505,-0.46; 29_6 -0.255,-0.46; 29_7 -2.755,-1.71; 29_8 -1.505,-1.71; 29_9 -0.255,-1.71
SOIC127P1032X265-16N = smd 2.05 x 0.59: 1 -4.655,4.445; 2 -4.655,3.175; 3 -4.655,1.905; 4 -4.655,0.635; 5 -4.655,-0.635; 6 -4.655,-1.905; 7 -4.655,-3.175; 8 -4.655,-4.445; 9 4.655,-4.445; 10 4.655,-3.175; 11 4.655,-1.905; 12 4.655,-0.635; 13 4.655,0.635; 14 4.655,1.905; 15 4.655,3.175; 16 4.655,4.445
SON50P200X200X80-9N = smd 0.76 x 0.27: 1 -0.985,0.75; 2 -0.985,0.25; 3 -0.985,-0.25; 4 -0.985,-0.75; 5 0.985,-0.75; 6 0.985,-0.25; 7 0.985,0.25; 8 0.985,0.75 | smd 0.9 x 1.3: 9 0,0

### Placement (x,y rotation side)
BOOT_BUTTON  24,108.65 180 top
C1  21.23,86.23 90 top
C1_BAT  19.24,28.83 90 top
C1_BAT1  24.71,37.27 180 top
C1_BAT2  143.85,42.07 0 top
C2  19.51,86.23 90 top
C2_BAT  11.55,26.43 90 top
C3  144.93,38.55 0 top
C4  98.94,34.71 90 top
C4_USB  153.65,60.45 90 top
C5  45.27,108.51 270 top
C5_USB  155.46,60.45 90 top
C6  19.99,108.23 270 top
C7  94.07,56.21 270 top
C8  96.66,57.81 180 top
C9  9.34,37.91 90 top
C10  59.62,107.91 270 top
C10_SUPERCAP  97.22,55.47 0 top
C_DELAY  54.04,99.07 270 top
CHANGE_BUTTON  63.65,108.65 180 top
CHG_LED  22.08,31 0 top
D1  154.82,56.77 0 top
D2  24.75,35.46 180 top
D3  91.34,34.05 0 top
D4  91.28,38.35 0 top
D5  82.02,42.35 0 top
D6  22.12,41.57 90 top
D7  96.6,60.86 180 top
D8  9.72,41.55 90 top
D9  26.46,41.55 90 top
D10  13.35,41.54 90 top
D11  17.12,41.56 270 top
D12  9.03,68.45 270 top
EPD_C1  95.77,19.25 89.9 top
EPD_C2  93.18,19.25 90 top
EPD_C5  75.05,19.39 270 top
EPD_C6  73.25,19.45 90 top
EPD_C7  71.1,19.45 89.8 top
EPD_C8  69.13,19.57 90 top
EPD_C9  66.79,19.63 90.4 top
EPD_C10  63.89,19.67 90 top
EPD_C11  60.88,19.7 90 top
EPD_C12  57.73,19.77 90 top
IC1  56.89,102.37 180 top
IC4  27.13,32.37 0 top
J1  85.1,13.87 0 top
J2  167.63,54.31 90 top
J3  165.25,19.3 90 top
J4  5.18,95.8 270 top
L1  81.71,36.7 0 top
MCP73831  15.21,27.04 270 top
PFMF.050.1  158.48,50.15 180 top
Q1  23.7,27.91 270 top
Q2  93.12,59.81 0 top
Q3  161.15,15.63 180 top
R1  18.83,41.51 270 top
R1_BAT  19.26,35.73 270 top
R1_PINH  21.09,82.73 90 top
R1_PINH1  87.02,63.49 90 top
R1_PWRUSB  22.21,33.39 0 top
R2  165.89,11.01 0 top
R2-PINH  19.62,82.75 90 top
R2-PINH1  89.58,63.49 90 top
R2-USB1  161.03,53.67 270 top
R2-USB2  161.02,56.75 90 top
R2_BAT  19.27,32.33 90 top
R3  164.09,15.61 90 top
R4  161.55,13.11 0 top
R5  23.92,41.61 270 top
R6  11.37,41.55 270 top
R7  15.17,41.46 270 top
R8  11.43,68.31 90 top
R9  20.35,41.57 270 top
R10  8.01,41.61 270 top
R_BOOT  28.34,106.15 270 top
R_CAPACITOR  96.59,59.15 180 top
R_CHANGE  67.38,107.59 270 top
R_CL1  20.25,69.33 90 top
R_RESET  53.44,108.39 270 top
RESET_BUTTON  48.9,108.65 180 top
SENSOR2  20.36,78.27 180 top
SJ1  165.86,13.07 0 top
TP1  40.8,60.6 0 top
TP2  43.9,60.6 0 top
TP3  19.1,22 0 top
TP4  51.4,57.6 0 top
TP5  47.6,57.6 0 top
TP6  42.1,53.9 0 top
TP7  51.3,53.9 0 top
TP8  48.1,53.9 0 top
TP9  58.6,60.2 0 top
TP10  60.1,53.9 0 top
TP11  48.7,60.43 0 top
TP12  56.5,57.7 0 top
TP13  53.8,60.4 0 top
TP14  11.5,22.2 0 top
TP15  55.5,53.9 0 top
TP16  15.2,22.1 0 top
TP17  84,32.3 0 top
U1  9.23,33.01 0 top
U2  13.14,55.69 90 top
U3  85.09,55.95 270 top
U4  20.4,74.07 180 top

### Tracks (layer width: path | path; a pad name or v marks a point on that pad's centre or on a via)
3V3
  Top 0.3: 13.12,36.55 U1.8 U1.7 13.12,33.43 12.38,32.68 12.38,29.98 12.1,29.7 4.7,29.7 4,30.4 4,31.54 4.83,32.38 U1.3 | 13.12,36.55 13.12,37.62 14.27,38.77 | 7.1,41.6 7.1,43.6 7.8,44.3 8.4,44.3 9.2,45.1 9.2,46.89 U2.2 | 7.1,41.6 7.1,39.1 8.94,37.26 C9.1 9.38,37.3 10.8,37.3 11.37,37.87 11.37,38.3 | R7.2 15.17,39.67 14.27,38.77 | 18,39 18.83,39.83 R1.2 18.83,40.9 20.33,40.9 R9.2 | R5.2 23.7,40.74 23.7,39.7 23,39 | R10.2 7.74,40.96 7.1,41.6 | 14.27,38.77 17.77,38.77 18,39 | 28.53,34.7 28.53,36.47 26.45,38.55 23.45,38.55 23,39 | 28.53,34.7 IC4.5 | 63.72,103.28 61.64,101.2 60.05,101.2 59.25,102 58.66,102 IC1.2 | 63.72,103.28 R_CHANGE.2 87.02,87.3 R1_PINH1.2 87.7,64.14 | 63.72,103.28 61.72,103.28 59.7,105.3 58.1,105.3 56.1,107.3 | 87.7,64.14 R2-PINH1.2 90.08,64.14 93.22,61 Q2.3 93.7,60.91 | U3.2 88.27,63.58 87.7,64.14 | 93.7,60.91 95.5,60.91 D7.2 | 93.7,60.91 95.99,63.2 122.07,63.2 C1_BAT2.1 143.2,38.78 C3.+ 158.35,23.63 158.35,22.33 161.88,18.8 J3.2 166.52,18.8 167.2,18.12 167.2,15.4 168.3,14.3 168.3,8.8 167.2,7.7 97.71,7.7 94.55,10.85 17.75,10.85 10.4,18.2 10.4,19.1 11.8,20.5 14.3,20.5 15.2,21.4 TP16.TP 13.6,23.7 10.9,23.7 10,24.6 10,27.5 10.8,28.3 12.9,28.3 14.1,29.5 14.8,29.5 15.2,29.1 15.2,26.96 15.53,26.62 15.53,25.67 15.8,25.4 19.6,25.4 22.1,27.9 23,27.9 23.6,28.5 23.6,32 24.3,32.7 24.3,33.5 25,34.2 28.03,34.2 28.53,34.7 | 56.1,107.3 56.09,107.29 56.77,106.6 55.79,106.6 54.46,105.27 29.06,105.27 28.84,105.5 R_BOOT.2 6.1,105.5 4.1,103.5 4.1,93.9 3.1,92.9 3.1,91.1 3.9,90.3 J4.P4 4.51,89.83 4.31,89.83 4.15,89.67 4.15,73.81 6.81,71.15 9.24,71.15 R8.2 13.93,68.96 14.67,69.7 19.97,69.7 R_CL1.2
  Top 0.3: 56.1,107.3 55.66,107.74 R_RESET.2 | 23,39 18,39 | R6.2 11.37,38.3 | 11.37,38.3 13.12,36.55
32KHZ  (via drill 0.35)
  Top 0.152: R2-PINH1.1 89.58,60.65 U3.1 89.53,59.23 v88.5,58.2 | v52.6,44.6 34,44.6 v33.9,44.5 | v30.7,44.5 30.4,44.8 23.3,44.8 22.9,45.2 v22.5,45.2 | v18.7,45.2 18.4,45.2 17.9,45.7 17.9,46.8 U2.9 | v87.2,56.9 84.8,54.5 65.4,54.5 64.8,53.9 v64.8,50.4 | v62,49.9 56.8,49.9 53.75,46.85 v53.6,46.85
  Bottom 0.152: v33.9,44.5 v30.7,44.5 | v22.5,45.2 v18.7,45.2 | v88.5,58.2 v87.2,56.9 | v64.8,50.4 64.3,49.9 v62,49.9 | v52.6,44.6 53.6,45.6 v53.6,46.85
DN
  Top 0.152: J2.A7 165.46,54.56 166.4,55.5 166.4,60.8 164.8,62.4 161.2,62.4 157.8,59 157.8,56.3 157.32,55.82 D1.4 156.1,55.79 156.1,54.2 157.8,52.5 157.8,49.08 160.78,46.1 165.5,46.1 167.05,47.65 167.05,52.35 165.84,53.56 J2.B7
DP
  Top 0.152: D1.6 161.05,62.7 164.9,62.7 166.7,60.9 166.7,55.3 165.46,54.06 J2.A6 163.44,54.06 163.18,54.33 163.18,54.79 163.38,55 163.89,55 J2.B6
EPD_3V3  (via drill 0.35)
  Top 0.3: J1.16 J1.15 | Q2.2 C7.1 88.36,56.86 84.5,53 78.5,53 77.3,51.8 77.3,49 78.4,47.9 83.7,47.9 86.1,45.5 86.1,38.8 L1.2 TP17.TP 84,23.1 87.87,19.23 96.33,19.23 96.36,19.2 96.7,19.2 97.3,18.6 v97.3,15.8 | EPD_C5.2 75.56,18.74 76.6,17.7 82.7,17.7 83.85,16.55 J1.15 | v97.3,13.9 96.6,13.2 93.3,13.2 92.6,13.9 84.2,13.9 83.85,14.25 J1.15
  Bottom 0.3: v97.3,15.8 v97.3,13.9
EPD_3V3_C
  Top 0.3: Q2.1 91.03,57.67 64.83,57.67 59.8,62.7 56.1,62.7 TP13.TP 53.8,60.56 39.96,74.4 27.1,74.4 24.5,77 24.5,86.9 22.5,88.9 18.4,88.9 17.13,87.63 17.13,82.23 13.9,79 13.9,72.8 15.12,71.58 20.23,71.58 21.8,70.02 21.8,68.9 21.4,68.5 20.25,68.5 | R_CL1.1 20.25,68.5 | 20.25,68.5 20.25,64.77 U2.18
EPD_BUSY  (via drill 0.35)
  Top 0.152: J1.9 86.85,18.25 64.35,40.75 64.35,54.45 TP9.TP 55.8,60.2 54.7,59.1 53.3,59.1 46.8,65.6 v46.7,65.6 | v44.6,65.6 32.8,65.6 v32.7,65.5 | v30.3,66 24.7,66 v24.6,65.9 | v14.2,66 11,66 10.42,65.42 U2.26
  Bottom 0.152: v46.7,65.6 v44.6,65.6 | v32.7,65.5 32.2,66 v30.3,66 | v24.6,65.9 14.3,65.9 v14.2,66
EPD_CS  (via drill 0.35)
  Top 0.152: D6.2 22.12,42.42 21.62,42.92 21.05,42.92 R9.1 20.4,42.27 20.4,42.9 20.3,43 20.3,44.1 20.58,44.38 U2.11 20.58,47.38 21.09,47.89 26.71,47.89 27.9,46.7 v28.8,46.7 | J1.12 85.3,15.37 85.3,18.3 63.5,40.1 63.5,50.73 v63.33,50.9 | v61.9,52.7 60.7,53.9 TP10.TP 53.51,47.31 53.41,47.31 52.8,46.7 v33.7,46.7
  Bottom 0.152: v28.8,46.7 v33.7,46.7 | v61.9,52.7 63.33,51.27 v63.33,50.9
EPD_DC  (via drill 0.35)
  Top 0.152: v46.8,59.5 47.77,59.5 TP11.TP 50.67,60.43 55.19,55.91 61.89,55.91 63.79,54.01 63.79,40.51 85.85,18.45 J1.11 | v13.9,51.3 14,51.2 31.7,51.2 39.35,58.85 v39.4,58.85 | v11.9,49.3 12.96,48.24 U2.5
  Bottom 0.152: v46.8,59.5 46.2,58.9 39.45,58.9 v39.4,58.85 | v13.9,51.3 v11.9,49.3
EPD_RST  (via drill 0.35)
  Top 0.152: J1.10 86.3,15.37 86.3,18.4 64.07,40.63 64.07,54.13 60.5,57.7 TP12.TP 53.9,57.7 49.9,61.7 46.8,61.7 v46.7,61.6 | v38.1,59.3 36.3,59.3 34.7,60.9 v13.7,60.9 | v15.2,62.6 16.77,64.17 U2.21
  Bottom 0.152: v46.7,61.6 44.4,59.3 v38.1,59.3 | v13.7,60.9 13.7,61.1 v15.2,62.6
FLASH_CS  (via drill 0.35)
  Top 0.152: U1.1 5.33,34.69 6.11,33.92 6.11,33.37 5.76,33.02 4.42,33.02 3.2,31.8 3.2,30.1 3.95,29.35 12.84,29.35 18.22,34.72 18.22,37.12 19,37.9 v22.5,37.9 | U2.12 21.85,44.45 22.3,44 23.2,44 23.92,43.28 R5.1 23.96,42.3 D9.2 27.4,42.3 27.8,41.9 27.8,39.9 27.4,39.5 v27.1,39.5
  Bottom 0.152: v22.5,37.9 23.71,39.11 25.31,39.5 v27.1,39.5
GDR
  Top 0.152: J1.2 90.35,15.66 90.62,15.92 91.08,15.92 92.11,14.9 162.12,14.9 Q3.1 162.22,14.98 162.9,14.3 162.9,13.8 R4.2
GND  (via drill 0.35)  (55 unrouted)
  Top 0.152: C4_USB.2 152.4,61.1 152,60.7 152,59.1 152.6,58.5 154,58.5 154.5,58 154.5,57.1 154.17,56.77 D1.2 | SJ1.1 165.1,11.15 R2.1 165.05,11.2 162.7,11.2 160.9,13 R4.1 | 58.29,103.59 58.29,104.19 58.3,104.2 57.8,104.7 56.7,104.7 55.87,105.53 55.49,105.53 54.5,104.54 54.5,103.9 | C_DELAY.2 53.38,98.42 53.1,98.7 53.1,100.6 53.5,101 54.2,101 54.5,101.3 54.5,103.9 | 47.11,107.86 RESET_BUTTON.1 | SENSOR2.7 20.87,77.87 20.4,77.4 20.4,77.2 20.27,77.07 SENSOR2.1 18.17,77.07 v18,76.9 | 22.6,41.6 24.9,41.6 25.2,41.3 25.2,41.1 25.5,40.8 D9.1 26.46,40.46 25.9,39.9 24.8,39.9 24.45,39.55 24.45,39 26.6,39 27.2,38.4 27.9,38.4 30.9,41.4 | 22.6,41.6 17.83,41.6 D11.1 16.41,42.31 v16.2,42.1 | 22.6,41.6 22.12,41.12 D6.1 22.12,39.72 v22.1,39.7 | 10.6,41.6 12,41.6 12.3,41.3 12.3,41 12.51,40.79 D10.1 13.35,39.86 v13.3,39.8 | 10.6,41.6 10.1,41.6 9.72,41.22 D8.1 9.72,38.94 C9.2 10.04,38.56 v10.5,38.1 | R2_BAT.1 19.59,32 20.6,32 21.56,32.96 R1_PWRUSB.1 21.5,33.45 21.5,34.6 20.4,35.7 18.8,35.7 18.5,36 18.5,36.8 18.97,37.27 C1_BAT1.2 22.93,38.4 v21.3,38.4 | RESET_BUTTON.2 51.6,107.9 51.9,107.6 v51.9,105.8 | v51.1,104.4 54,104.4 54.5,103.9 | 7.9,64.42 U2.28 | v9.7,61 10.4,61 11.5,59.9 11.5,56.5 12.35,55.65 U2.29_3 | 7.9,64.42 7.9,65 6.56,66.34 v6.56,66.56 | U2.1 7.9,46.92 v7.9,45.5 7.9,45.4 | v10.2,43.4 10.3,43.4 10.6,43.1 10.6,41.6 | v35.9,50.4 43.1,50.4 46.4,53.7 46.4,56.4 TP5.TP TP4.TP | v31.3,50.3 31.8,49.8 31.8,42.3 30.9,41.4 | 21.95,107.9 22.18,107.9 BOOT_BUTTON.1 22.25,107.45 | U2.29_5 U2.29_8 | v18,75.4 18,74.8 18.48,74.32 U4.6 | D12.1 8.98,69.15 | 8.98,69.15 7.7,67.87 v7.7,67.1 | 25.76,32.4 IC4.2
  Top 0.152: J2.A12 163.95,57.5 | 163.95,57.5 J2.B1 | 161.38,54.32 R2-USB1.1 | J2.MP4 161.32,59.42 159.7,57.8 159.7,55.7 160.2,55.2 161.21,55.2 161.67,55.67 161.67,55.69 163.48,57.5 163.95,57.5 | J2.A1 163.95,49.78 J2.MP3 v166,49.2 | v168.5,47.6 168.46,47.64 J2.MP1 | v2.53,94.06 2.53,95.15 J4.G4 2.33,95.03 1.4,94.1 1.4,89.9 v3.2,88.1 | v3.74,91.88 4.36,92.5 J4.P6 13.98,92.5 J4.G2 15,90.9 14,89.9 11.9,89.9 6.7,84.7 6.7,72.8 8,71.5 9.39,71.5 11.38,69.51 13.91,69.51 14.49,70.09 19.27,70.09 19.6,70.42 19.6,70.7 19.1,71.2 14.8,71.2 13.4,72.6 13.4,79.6 16.4,82.6 16.4,84.6 15.69,85.31 | C6.2 18.8,106.39 2.28,106.39 0.63,104.74 0.63,86.21 3.4,83.44 3.4,66.79 3.59,66.6 3.9,66.6 4.34,67.05 4.34,71.54 5.1,72.3 5.16,72.3 8.31,69.15 8.98,69.15 | 7.9,64.42 7.9,61.6 v8.5,61 | C2.2 18.58,86.88 v18,86.3 | v16.6,86.2 16.58,86.2 15.69,85.31 | 15.69,85.31 J4.G1 | C10.2 59.62,106.42 v59.2,106 | v59.2,104.5 58.29,103.59 | 58.29,103.59 IC1.3 | C3.- 159,25.98 159,22.7 v162,19.7 | v162.4,18.1 162.9,17.6 165.05,17.6 J3.1 | 13.87,27.08 MCP73831.2 14.38,26.57 14.59,26.57 14.76,26.41 v14.91,26.41 | C1_BAT.2 16.96,27.2 v16.5,27.2 | EPD_C12.2 57.48,20.42 56.6,21.3 56.6,44.4 54.6,46.4 34.2,46.4 33.4,45.6 v33.4,43.5 | 30.9,43.2 v30.9,43.3 30.9,41.4 | v1.25,83.85 1.2,83.8 1.2,82.33 J4.G3 | v10.5,36.7 10.5,34.28 U1.9
  Bottom 0.152: v51.9,105.8 51.9,105.2 v51.1,104.4 | v13.3,39.8 15.8,39.4 16.2,39.8 v16.2,42.1 | v9.7,61 v8.5,61 | v7.7,67.1 7.1,67.1 v6.56,66.56 | v7.9,45.5 7.9,44.7 9.2,43.4 v10.2,43.4 | v22.1,39.7 22.1,39.2 v21.3,38.4 | v35.9,50.4 31.4,50.4 v31.3,50.3 | v18,76.9 v18,75.4 | v166,49.2 167.6,47.6 v168.5,47.6 | v2.53,94.06 3.74,92.85 v3.74,91.88 | v18,86.3 17.9,86.2 v16.6,86.2 | v59.2,106 v59.2,104.5 | v162,19.7 162.4,19.3 v162.4,18.1 | v16.5,27.2 15.8,26.5 14.81,26.5 v14.91,26.41 | v33.4,43.5 33.2,43.3 v30.9,43.3 | v3.2,88.1 3.2,85.7 1.3,83.8 v1.25,83.85 | v10.5,38.1 v10.5,36.7
  pour Top: -5.14,118.14 -5.12,118.12 -5.12,-13.02 185.82,-13.02 185.82,118.92 -5.92,118.92
  pour Bottom: -10.14,126.24 -10.12,126.22 -10.12,-18.52 197.23,-18.52 197.22,-18.52 197.22,126.37 197.17,126.42 -10.32,126.42
GPIO8
  Top 0.152: U2.10 19.31,44.61 18.9,44.2 18.9,42.23 R1.1
I2C_PW
  Top 0.3: SENSOR2.2 17.87,77.87 17.3,77.3 17.3,76.7 18,76 22.3,76 22.65,76.35 | 22.65,76.35 23.3,77 23.3,78.1 | 23.3,78.1 23.3,82.5 22.4,83.4 21.07,83.4 | R2-PINH.2 21.07,83.4 | 21.07,83.4 R1_PINH.2 | R2-PINH.2 15,78.78 15,73.2 16.19,72.01 20.89,72.01 22.23,70.67 22.23,67.17 21.85,66.8 U2.17 | C1.1 C2.1 19.51,83.51 R2-PINH.2 | SENSOR2.8 21.93,77.07 22.65,76.35 | SENSOR2.6 22.73,78.67 23.3,78.1
INT_RTC  (via drill 0.35)
  Top 0.152: v33.4,47.6 51.8,47.6 55.5,51.3 TP15.TP 56.5,54.9 v58.9,54.9 | v30.5,47.6 29.7,48.4 17.6,48.4 16.77,47.57 U2.8 | R1_PINH1.1 87.02,60.63 U3.3 86.99,59 v86.3,58.3 | v64.7,54.9 83.6,54.9 v85.5,56.8
  Bottom 0.152: v33.4,47.6 v30.5,47.6 | v58.9,54.9 v64.7,54.9 | v86.3,58.3 86.3,57.6 v85.5,56.8
IO/BOOT  (via drill 0.35)
  Top 0.152: 26.11,109.7 25.75,109.7 BOOT_BUTTON.3 | 26.11,109.7 27.26,109.7 28.34,108.62 R_BOOT.1 | v7.8,75.1 7.9,75.1 8.7,74.3 8.7,73.8 9.85,72.65 12.21,72.65 14.3,70.55 v18.99,70.55 v19,70.55 | 26.11,109.7 25.81,109.4 BOOT_BUTTON.4 21.73,108.88 C6.1 18.71,107.6 3,107.6 0.35,104.95 0.35,85.92 2.86,83.4 2.86,76.13 v2.6,75.87 | v22.7,66.9 24.39,65.21 U2.15
  Bottom 0.152: v2.6,75.87 3.37,75.1 v7.8,75.1 | v22.7,66.9 20,66.9 19.5,67.4 19.5,69.9 19,70.4 v19,70.55
IO/CHANGE  (via drill 0.35)
  Top 0.152: 65.7,109.7 62.2,109.7 CHANGE_BUTTON.4 60.46,109.4 C10.1 55.56,108.56 v55.3,108.3 | R_CHANGE.1 67.18,108.24 65.72,109.7 65.7,109.7 | CHANGE_BUTTON.3 65.7,109.7 | v52.5,103.8 50.7,103.8 49.9,104.6 6.3,104.6 4.8,103.1 4.8,96.4 5.7,95.5 15.62,95.5 17.22,93.89 17.22,89.98 16.4,89.15 14.9,89.15 7.54,81.79 7.54,76.16 9,74.7 9,73.9 9.7,73.2 11.4,73.2 v11.5,73.3 | v18.71,69.09 15.01,65.39 14.97,65.39 14.23,64.66 U2.23
  Bottom 0.152: v18.71,69.09 18.2,69.6 18.2,72.9 17.7,73.4 11.6,73.4 v11.5,73.3 | v55.3,108.3 52.5,105.5 v52.5,103.8
MISO  (via drill 0.35)
  Top 0.152: 9.15,62.8 U2.27 9.03,64.56 9.03,65.17 | 9.15,62.8 9.15,50.35 6.75,47.95 6.75,46.55 6.7,46.5 6.7,37.7 5.6,36.6 4.6,36.6 4.1,36.1 4.1,34.88 U1.2 | TP6.TP 42.1,57 36.8,62.3 32.1,62.3 31.32,61.52 10.43,61.52 9.15,62.8 | 9.03,65.17 D12.2 11.39,67.7 R8.1 | 9.03,65.17 8.2,66 7.66,66 7.11,66.54 7.11,69.7 v7.06,69.76 | J4.P7 13.56,93.6 15.04,92.12 16.52,92.12 16.8,91.84 16.8,90.16 16.83,90.13 16.16,89.46 12.02,89.46 7.26,84.7 7.26,72.89 v7.5,72.64
  Bottom 0.152: v7.06,69.76 7.1,69.8 7.1,72.24 v7.5,72.64
MOSI  (via drill 0.35)
  Top 0.152: D11.2 17.2,40.81 17.2,40.2 | 17.2,40.2 v17.2,39.3 | v18.2,38.3 17.7,37.8 17.7,35.68 U1.5 | 16.4,48.5 16.9,49 v30.4,49 | v34.6,49 49.6,49 51.3,50.7 TP7.TP 52.75,55.35 61.55,55.35 62.6,54.3 62.6,39.7 84.35,17.95 J1.14 | J4.P3 6.4,89.2 7.4,88.2 7.4,86.19 5.4,84.19 v5.4,73.4 | v13.9,48.9 12.8,50 11.03,50 v10.9,50.13 | v16,48.9 16.4,48.5 | 17.2,40.2 16.9,39.9 16.2,39.9 15.8,40.3 15.8,40.36 15.82,40.38 15.82,41.58 15.28,42.12 15.27,42.11 R7.1 15.17,42.93 14.9,43.2 14.9,45.1 15.5,45.7 U2.7 15.5,47.6 16.4,48.5 | v5.5,70.8 5.5,66.48 6.95,65.04 6.95,51.05 v7.9,50.1
  Bottom 0.152: v17.2,39.3 v18.2,38.3 | v34.6,49 v30.4,49 | v13.9,48.9 v16,48.9 | v7.9,50.1 7.93,50.13 v10.9,50.13 | v5.5,70.8 5.5,73.25 5.4,73.35 v5.4,73.4
N$1
  Top 0.152: R2-USB1.2 159.32,53.02 159.32,47.95 160.77,46.5 165.4,46.5 166.6,47.7 166.6,52.2 165.74,53.06 J2.A5
N$3
  Top 0.152: R2-USB2.1 161.18,56.1 163.19,58.11 165.39,58.11 165.8,57.7 165.8,56.4 165.46,56.06 J2.B5
N$12  (via drill 0.35)
  Top 0.152: IC4.3 25.8,31.35 25.05,31.35 24.8,31.6 24.8,32.4 | 24.8,32.4 24.8,33.1 25.1,33.4 25.65,33.4 IC4.1 25.75,33.3 26.5,33.3 26.6,33.4 v26.6,33.6 | C1_BAT1.1 25.36,36.24 26,35.6 26,35.46 D2.1 26.04,35.46 v26.6,34.9 | 24.8,32.4 24,31.6 24,28.25 22.71,26.96 Q1.2
  Bottom 0.152: v26.6,34.9 v26.6,33.6
N$17
  Top 0.152: C4.1 D3.2 93.09,34.95 94.19,36.05 94.19,38.75 93.69,39.25 90.13,39.25 89.53,38.65 D4.1
N$22
  Top 0.152: R1_BAT.1 20.52,36.38 22.2,34.7 22.2,31.87 CHG_LED.C
N$23  (via drill 0.35)
  Top 0.152: MCP73831.1 14,28.08 14,28.65 v14.12,28.78 | R1_BAT.2 15.7,31.52 v15.7,31.36
  Bottom 0.152: v15.7,31.36 14.5,30.16 14.5,29.2 14.12,28.82 v14.12,28.78
N$25
  Top 0.152: MCP73831.5 17.7,29.18 17.7,32.41 18.27,32.98 R2_BAT.2
N$28
  Top 0.152: EPD_C1.1 93.67,16.5 89.7,16.5 89.35,16.15 J1.4
N$29
  Top 0.152: EPD_C2.1 91.58,17 89.4,17 88.85,16.45 J1.5
N$37
  Top 0.152: EPD_C6.1 73.25,17.75 73.65,17.35 80.66,17.35 82.35,15.66 J1.18
N$38
  Top 0.152: EPD_C7.1 71.1,17.3 71.33,17.07 80.44,17.07 81.9,15.6 81.9,15.37 J1.19
N$39
  Top 0.152: EPD_C8.1 69.13,17.17 69.54,16.76 80.35,16.76 81.3,15.8 81.3,15.37 J1.20
N$41
  Top 0.152: EPD_C10.1 64.98,19.02 65.2,18.8 65.2,16.9 65.91,16.19 78.99,16.19 79,16.2 79.8,16.2 80.35,15.66 J1.22
N$43
  Top 0.152: EPD_C12.1 58.88,19.12 59.3,18.7 59.3,16.9 60.88,15.32 J1.24
N$56
  Top 0.152: C_DELAY.1 54.12,99.8 54.6,99.8 55,100.2 55,100.6 55.49,101.09 IC1.5
N$68
  Top 0.152: D7.1 R_CAPACITOR.2
PREVGH  (via drill 0.35)
  Top 0.152: EPD_C9.1 67,19.18 67.52,19.18 67.8,18.9 | 67.8,18.9 67.8,17.1 68.42,16.48 80.12,16.48 80.85,15.75 J1.21 | 67.8,18.9 67.8,22 68.4,22.6 v78,22.6 | D5.1 80.27,40.87 79.4,40 78.5,40 77.9,39.4 77.9,36.6 78.6,35.9 78.6,33.8 83.3,29.1 83.3,25.1 82.6,24.4 v82.5,24.4
  Bottom 0.152: v82.5,24.4 80.6,22.5 78.1,22.5 v78,22.6
PREVGL  (via drill 0.35)
  Top 0.152: EPD_C11.1 60.88,17.02 61.99,15.91 79.1,15.91 79.12,15.92 79.58,15.92 79.85,15.66 J1.23 79.8,15.27 v79.8,14.2 | D4.2 91.2,36.52 91.2,22.8 v88.95,20.55
  Bottom 0.152: v88.95,20.55 82.6,14.2 v79.8,14.2
RESE
  Top 0.152: R3.2 162.9,16.26 | 162.9,16.26 162.22,16.26 Q3.2 | 162.9,16.26 163.23,15.93 162.73,15.43 160.97,15.43 160.71,15.18 92.62,15.18 91.6,16.2 90.5,16.2 90.2,16.2 89.85,15.85 J1.3
RESE'
  Top 0.152: R3.1 166.94,14.96 167.8,14.1 167.8,12.4 | 167.8,12.4 167.8,11.5 167.31,11.01 R2.2 | SJ1.2 167.13,13.07 167.8,12.4
RESET  (via drill 0.35)
  Top 0.152: IC1.1 57.78,101.42 56.6,102.6 56.6,104.16 v55.68,105.08 | v10.22,60.2 10.22,47.04 10.32,46.94 U2.3 | v54.37,105.93 53.07,105.93 52.4,106.6 52.4,108.1 53.34,109.04 R_RESET.1 53.44,109.16 53.2,109.4 RESET_BUTTON.3 RESET_BUTTON.4 46.71,108.96 45.47,108.96 C5.1 44.46,109.16 43.5,108.2 43.5,107.1 42.45,106.05 27.8,106.05 2.35,106.05 0.91,104.61 0.91,89.75 3.68,86.98 3.68,67.62 v3.85,67.45
  Bottom 0.152: v55.68,105.08 55.22,105.08 v54.37,105.93 | v10.22,60.2 10.22,63.58 9.4,64.4 7.9,64.4 5.1,67.2 4.1,67.2 v3.85,67.45
RTC_RST  (via drill 0.35)
  Top 0.152: U3.4 85.72,65.08 85,65.8 66.2,65.8 63.6,68.4 47.3,68.4 v45.5,70.2 | v43.4,68.5 33.9,68.5 28.59,63.19 23.61,63.19 23,63.8 23,64.32 U2.16
  Bottom 0.152: v45.5,70.2 43.8,68.5 v43.4,68.5
RX
  Top 0.152: TP2.TP 43.8,60.7 43.8,61.5 42.2,63.1 31.5,63.1 30.5,62.1 14.4,62.1 12.96,63.54 U2.24
SCK  (via drill 0.35)
  Top 0.152: U1.6 14.53,33.78 14.53,37.67 v14.5,37.7 | v35.2,49.7 46.6,49.7 48.1,51.2 TP8.TP 49.83,55.63 61.77,55.63 62.88,54.52 62.88,40.02 84.9,18 84.9,15.37 J1.13 | J4.P5 6.6,91.4 7.8,90.2 7.8,86.2 5.9,84.3 5.9,72.81 v6.25,72.46 | v30.2,49.8 16.26,49.8 | v11.21,50.71 v11.22,50.7 15.36,50.7 16.26,49.8 | v13.3,38.9 14.4,40 14.4,41.8 13.9,42.3 D10.2 11.47,42.29 R6.1 11.5,42.2 11.5,44.3 12.2,45 13.2,45 14.23,46.03 U2.6 14.2,46.97 14.2,48.5 15.5,49.8 16.26,49.8 | v8.5,50.7 7.23,51.97 7.23,65.25 6.11,66.37 6.11,70.21 v6.3,70.4
  Bottom 0.152: v13.3,38.9 v14.5,37.7 | v35.2,49.7 30.4,49.7 30.3,49.8 v30.2,49.8 | v8.5,50.7 v11.2,50.7 v11.21,50.71 | v6.3,70.4 6.3,72.29 6.25,72.34 v6.25,72.46
SCL  (via drill 0.35)
  Top 0.152: R2-PINH.1 19.62,80.19 SENSOR2.4 17.67,79.47 15.8,77.6 15.8,74.3 | U4.7 18.41,73.82 17.35,74.88 16.38,74.88 15.8,74.3 | 15.8,74.3 15.8,74.1 16.8,73.1 v16.8,72.8 | v160.15,23.95 163.39,20.71 165.16,20.71 J3.4 | v156.3,24 156.2,23.9 146,23.9 122.7,47.2 90.9,47.2 89.5,48.6 89.5,51.26 U3.16 90.64,52.4 100.5,52.4 102.1,54 v102.1,61.7 | v102.5,64.2 100.2,66.5 v87.7,66.5 | v86,66.5 66.5,66.5 63.8,69.2 47.65,69.2 v47.6,69.25 | v18.12,67.58 18.04,67.5 U2.20 18.04,63.16 18.68,62.52 28.82,62.52 33.79,67.5 45,67.5 v45.1,67.6
  Bottom 0.152: v16.8,72.8 17.3,72.3 17.3,68.4 v18.12,67.58 | v160.15,23.95 160.1,24 v156.3,24 | v102.5,64.2 102.1,63.8 v102.1,61.7 | v87.7,66.5 v86,66.5 | v47.6,69.25 47.55,69.2 46.8,69.2 45.2,67.6 v45.1,67.6
SDA  (via drill 0.35)
  Top 0.152: R1_PINH.1 21.09,80.49 19.27,78.67 SENSOR2.3 18.83,78.6 17.3,78.6 16.6,77.9 v16.6,75.7 | v159.5,23.3 163,19.8 J3.3 | v157.2,23.4 146,23.4 122.6,46.8 89.9,46.8 88.2,48.5 88.2,51.23 U3.15 88.27,52.07 88.9,52.7 100.3,52.7 101.6,54 v101.6,62.5 | v17.5,72.8 17.59,72.8 17.81,73.02 19.11,73.02 U4.8 19.39,73.3 18.54,73.3 17.64,74.2 v17,74.2 | v18.83,68 18.83,65.87 19.31,65.39 19.31,64.8 | v101.6,64.1 101.6,64.6 100,66.2 88.3,66.2 v87.8,65.7 | v86.1,65.7 85.6,66.2 66.4,66.2 63.8,68.8 47.41,68.8 46.67,69.54 v46.67,69.67 | 19.31,64.8 U2.19 | 19.31,64.8 19.3,64.79 19.3,63.3 19.8,62.8 28.7,62.8 33.9,68 44.5,68 v44.6,68.1
  Bottom 0.152: v16.6,75.7 16.6,74.6 v17,74.2 | v159.5,23.3 159.4,23.4 v157.2,23.4 | v101.6,62.5 v101.6,64.1 | v87.8,65.7 v86.1,65.7 | v17.5,72.8 17.5,72.5 17.58,72.42 17.58,69.25 v18.83,68 | v44.6,68.1 45.1,68.1 v46.67,69.67
SRC  (via drill 0.35)
  Top 0.152: L1.1 79.1,36.7 78.4,37.4 78.4,39.3 78.8,39.7 83.4,39.7 83.77,40.07 D5.2 85.15,42.35 v85.2,42.4 | Q3.3 160,15.53 102.97,15.53 99.59,18.91 99.59,34.49 98.94,35.15 C4.2 97,37.3 97,40.2 94.8,42.4 v87.2,42.4
  Bottom 0.152: v85.2,42.4 v87.2,42.4
SS_SD  (via drill 0.35)
  Top 0.152: R10.1 8.65,42.9 9.12,42.9 D8.2 9.72,43.56 11.69,45.53 U2.4 11.69,48.41 10.87,49.23 v10.87,49.5 | J4.P2 5.68,88 6.5,88 7.1,87.4 7.1,86.3 4.9,84.1 v4.9,74.2 | v4.95,71.5 4.65,71.2 v4.65,66.15
  Bottom 0.152: v4.9,74.2 4.95,74.15 v4.95,71.5 | v4.65,66.15 5.05,65.75 5.84,65.75 8,63.6 8,51.3 7.5,50.8 7.5,50.4 6.9,49.8 6.9,49.4 7.3,49 10.37,49 v10.87,49.5
TX
  Top 0.152: TP1.TP 40.85,60.65 38.8,62.7 31.8,62.7 30.9,61.8 13.47,61.8 11.69,63.58 U2.25
USB_D+  (via drill 0.35)
  Top 0.152: D1.1 152.62,57.72 151.12,56.22 151.12,47.88 163.57,35.43 v163.57,22.2 | v30.8,46.1 25.23,46.1 U2.14 | v162.47,8.61 97.69,8.61 94.3,12 58.59,12 55.9,14.7 55.9,44.4 54.28,46.02 34.77,46.02 v34.7,45.95
  Bottom 0.152: v162.47,8.61 163.57,9.71 v163.57,22.2 | v34.7,45.95 34.55,46.1 v30.8,46.1
USB_D-  (via drill 0.35)
  Top 0.152: D1.3 153.57,54.82 151.5,52.75 151.5,48 164,35.5 164,23.1 v164.1,23 | v33.9,45.4 54.3,45.4 55.4,44.3 55.4,14.8 58.6,11.6 94.31,11.6 97.85,8.05 162.75,8.05 v163.8,9.1 | v30.7,45.3 23.8,45.3 23.12,45.98 U2.13
  Bottom 0.152: v164.1,23 164.1,9.4 v163.8,9.1 | v33.9,45.4 30.8,45.4 v30.7,45.3
VBAT
  Top 0.152: MCP73831.3
  Top 0.3: 19.9,24.9 22.9,24.9 24.8,26.8 Q1.3 29.21,27.91 32.6,31.3 32.6,48.4 35.5,51.3 42.1,51.3 45.63,54.83 45.63,68.13 39.93,73.82 23.4,73.82 | 19.9,24.9 15.1,24.9 MCP73831.3 | 23.4,73.82 U4.2 | U4.3 22.9,74.32 23.4,73.82 | C2_BAT.1 11.85,26.08 MCP73831.3 | TP3.TP 19.1,24.1 19.9,24.9
VBUS
  Top 0.3: CHG_LED.A 20.01,28.18 C1_BAT.1 18.6,28.18 MCP73831.4 15.96,26.64 15.96,26.8 15.63,27.13 15.63,29.92 14.77,30.78 12.72,28.73 10.43,28.73 9.5,27.8 9.5,24.2 | 154.9,56 154.9,51.48 PFMF.050.1.2 167.63,38.75 167.63,15.8 168.9,14.53 168.9,8.5 167.5,7.1 97.7,7.1 94.38,10.43 17.37,10.43 9.5,18.3 9.5,24.2 | 154.9,56 155.67,56.77 D1.5 | Q1.1 22.08,29.48 CHG_LED.A | CHG_LED.A 22.86,31.03 R1_PWRUSB.2 22.86,34.62 D2.2 | C4_USB.1 C5_USB.1 155.46,58.46 154.9,57.9 154.9,56 | TP14.TP 9.5,24.2
VRTC
  Top 0.152: R_CAPACITOR.1 97.31,59.08
  Top 0.3: U3.14 86.99,52.5 88,53.5 97.6,53.5 98.32,54.22 C10_SUPERCAP.2 98.32,56.8 C8.1 97.31,59.08
VUSB
  Top 0.3: PFMF.050.1.1 161.72,50.15 162.24,50.66 162.24,51.24 162.74,51.74 | 162.74,51.74 162.8,51.8 163.91,51.8 J2.A4 J2.B9 | 162.74,51.74 162.74,56.14 163.16,56.56 J2.B4 J2.A9